# EAGLE schematic tr02 (EAGLE 6.6.0)

## Sheet 1 of 10
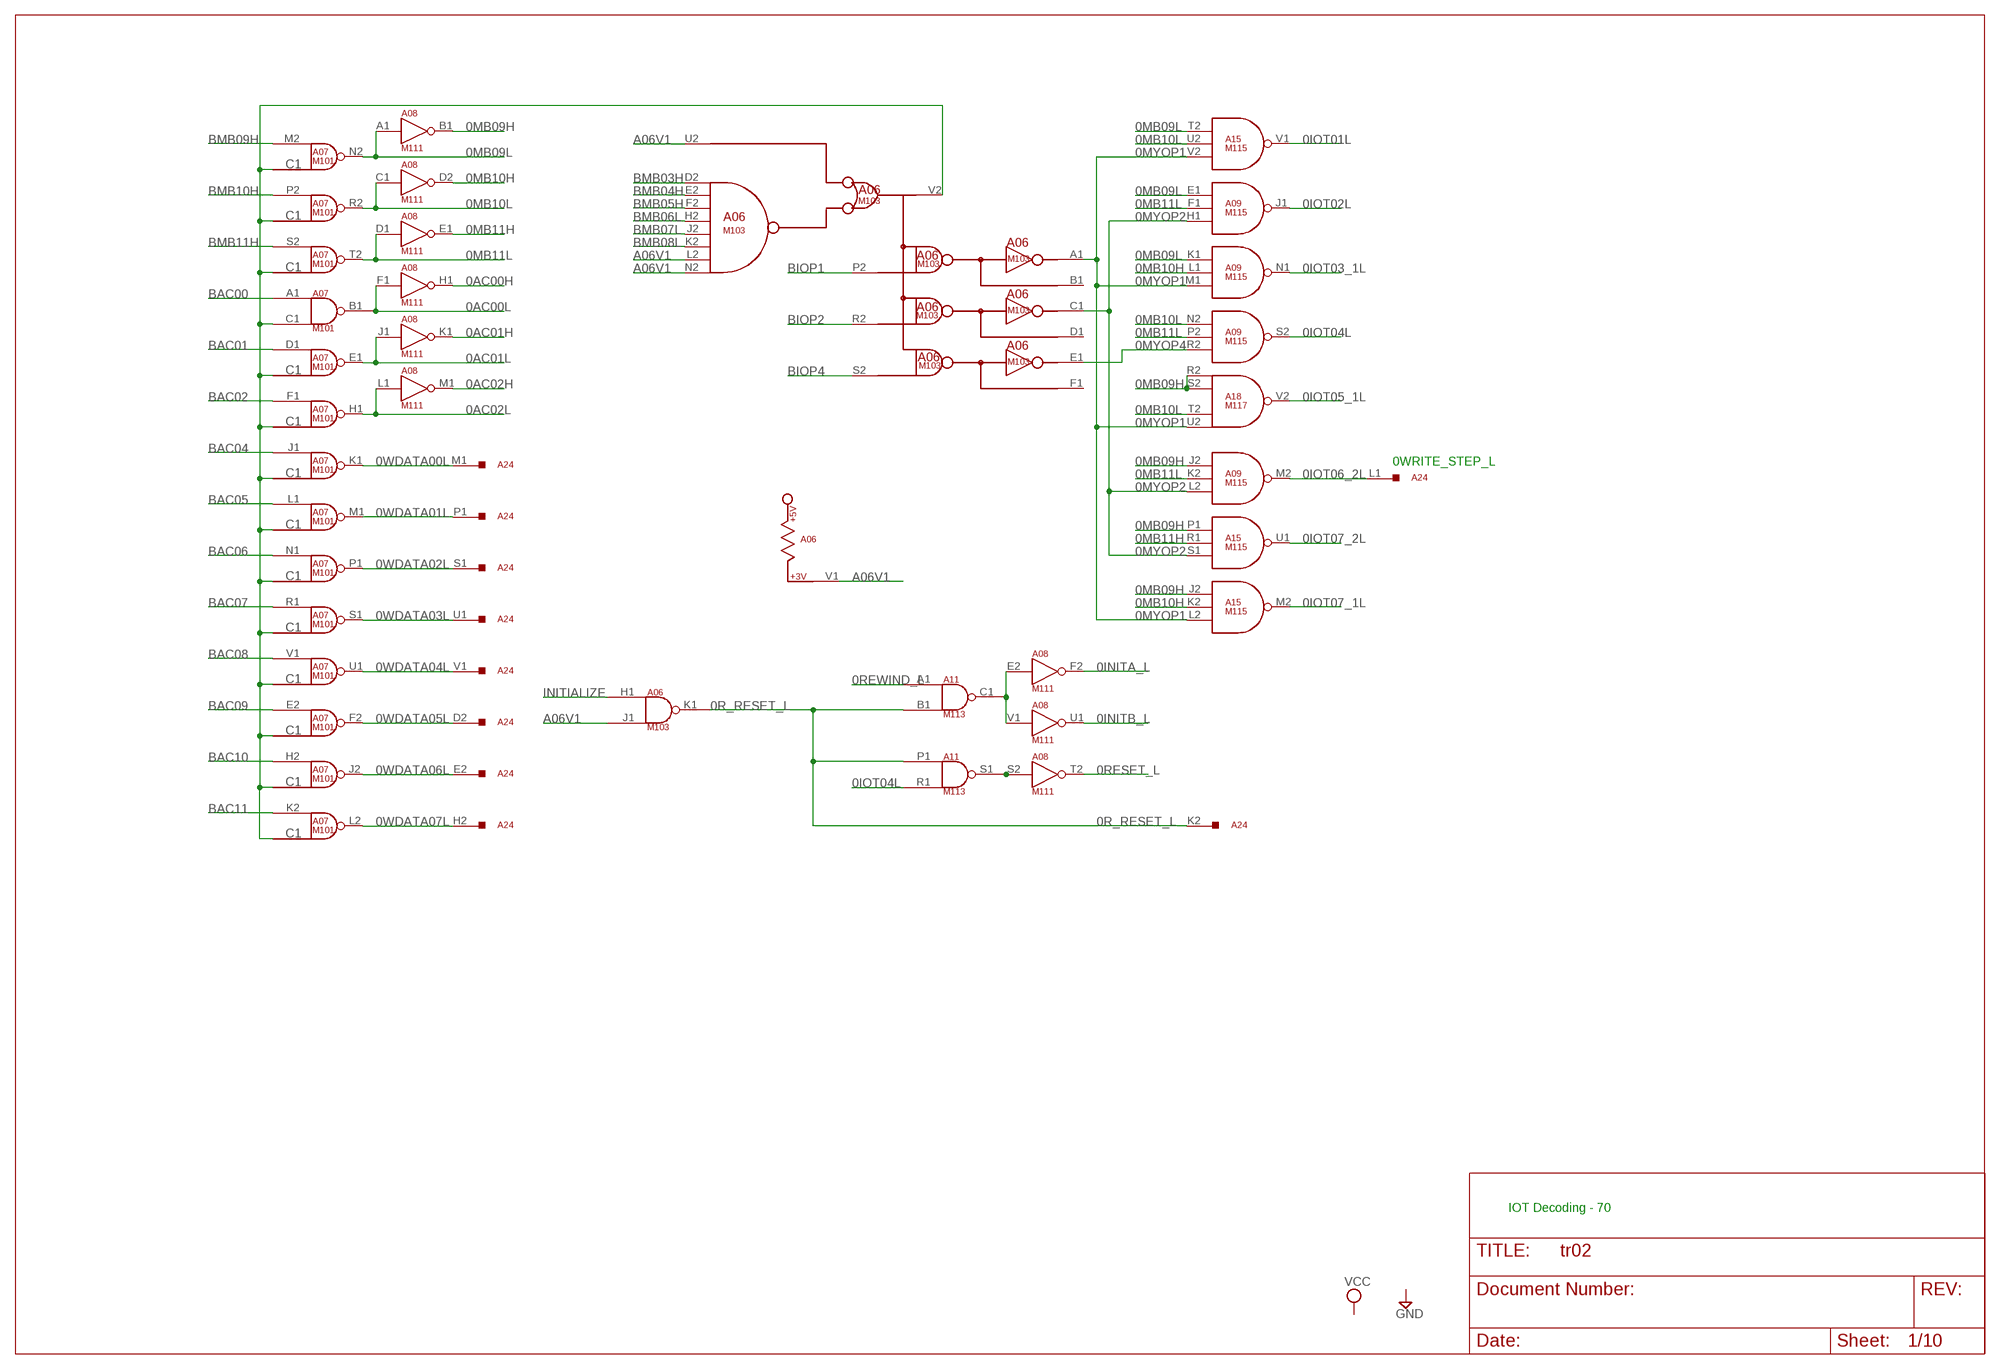
[diagram p0: schematic, sheet 1]

### Parts
A06  M103  [H807]
A07  M101  [H807]
A08  M111  [H807]
A09  M115  [H807]
A11  M113  [H807]
A15  M115  [H807]
A18  M117  [H807]
A24  G784  M916  [H807]

### Nets
0AC00H: A08.H1(H1:OUT) ; also sheet 3
0AC00L: A07.B1(B1:OUT) A08.F1(H1:IN) ; also sheet 3
0AC01H: A08.K1(K1:OUT) ; also sheet 3
0AC01L: A07.E1(E1:OUT) A08.J1(K1:IN) ; also sheet 3
0AC02H: A08.M1(M1:OUT) ; also sheet 3
0AC02L: A07.H1(H1:OUT) A08.L1(M1:IN) ; also sheet 3
0INITA_L: A08.F2(F2:OUT) ; also sheet 3
0INITB_L: A08.U1(U1:OUT) ; also sheet 3
0IOT01L: A15.V1(V1:OUT) ; also sheet 6
0IOT02L: A09.J1(J1:OUT) ; also sheet 5
0IOT03_1L: A09.N1(N1:OUT) ; also sheet 6
0IOT04L: A09.S2(S2:OUT) A11.R1(S1:IN2) ; also sheet 3
0IOT05_1L: A18.V2(V2:OUT) ; also sheet 6
0IOT06_2L: A09.M2(M2:OUT) A24.L1
0IOT07_1L: A15.M2(M2:OUT) ; also sheet 6
0IOT07_2L: A15.U1(U1:OUT) ; also sheet 5
0MB09H: A08.B1(B1:OUT) A09.J2(M2:IN1) A15.J2(M2:IN1) A15.P1(U1:IN1) A18.R2(V2:IN1) A18.S2(V2:IN2)
0MB09L: A07.N2(N2:OUT) A08.A1(B1:IN) A09.E1(J1:IN1) A09.K1(N1:IN1) A15.T2(V1:IN1)
0MB10H: A08.D2(D2:OUT) A09.L1(N1:IN2) A15.K2(M2:IN2)
0MB10L: A07.R2(R2:OUT) A08.C1(D2:IN) A09.N2(S2:IN1) A15.U2(V1:IN2) A18.T2(V2:IN3)
0MB11H: A08.E1(E1:OUT) A15.R1(U1:IN2)
0MB11L: A07.T2(T2:OUT) A08.D1(E1:IN) A09.F1(J1:IN2) A09.K2(M2:IN2) A09.P2(S2:IN2)
0MYOP1: A06.A1(V2:A1) A09.M1(N1:IN3) A15.L2(M2:IN3) A15.V2(V1:IN3) A18.U2(V2:IN4)
0MYOP2: A06.C1(V2:C1) A09.H1(J1:IN3) A09.L2(M2:IN3) A15.S1(U1:IN3)
0MYOP4: A06.E1(V2:E1) A09.R2(S2:IN3)
0R_RESET_L: A06.K1(K1:OUT) A11.B1(C1:IN2) A11.P1(S1:IN1) A24.K2
0RESET_L: A08.T2(T2:OUT) ; also sheet 5,6
0REWIND_L: A11.A1(C1:IN1) ; also sheet 3
0WDATA00L: A07.K1(K1:OUT) A24.M1
0WDATA01L: A07.M1(M1:OUT) A24.P1
0WDATA02L: A07.P1(P1:OUT) A24.S1
0WDATA03L: A07.S1(S1:OUT) A24.U1
0WDATA04L: A07.U1(U1:OUT) A24.V1
0WDATA05L: A07.F2(F2:OUT) A24.D2
0WDATA06L: A07.J2(J2:OUT) A24.E2
0WDATA07L: A07.L2(L2:OUT) A24.H2
A06V1: A06.J1(K1:IN2) A06.L2(V2:L2) A06.N2(V2:N2) A06.U2(V2:U2) A06.V1
BAC00: A07.A1(B1:IN1) ; also sheet 2,10
BAC01: A07.D1(E1:IN) ; also sheet 2,10
BAC02: A07.F1(H1:IN) ; also sheet 2,10
BAC04: A07.J1(K1:IN) ; also sheet 2,10
BAC05: A07.L1(M1:IN) ; also sheet 2,10
BAC06: A07.N1(P1:IN) ; also sheet 2,10
BAC07: A07.R1(S1:IN) ; also sheet 2,10
BAC08: A07.V1(U1:IN) ; also sheet 2,10
BAC09: A07.E2(F2:IN) ; also sheet 2,10
BAC10: A07.H2(J2:IN) ; also sheet 2,10
BAC11: A07.K2(L2:IN) ; also sheet 2,10
BIOP1: A06.P2(V2:P2) ; also sheet 2,10
BIOP2: A06.R2(V2:R2) ; also sheet 2,10
BIOP4: A06.S2(V2:S2) ; also sheet 2,10
BMB03H: A06.D2(V2:D2) ; also sheet 2,10
BMB04H: A06.E2(V2:E2) ; also sheet 2,10
BMB05H: A06.F2(V2:F2) ; also sheet 2,10
BMB06L: A06.H2(V2:H2) ; also sheet 2,10
BMB07L: A06.J2(V2:J2) ; also sheet 2,10
BMB08L: A06.K2(V2:K2) ; also sheet 10
BMB09H: A07.M2(N2:IN) ; also sheet 2,10
BMB10H: A07.P2(R2:IN) ; also sheet 2,10
BMB11H: A07.S2(T2:IN) ; also sheet 2,10
INITIALIZE: A06.H1(K1:IN1) ; also sheet 2,10
N$7: A06.V2(V2:V2) A07.C1(B1:IN2)
N$8: A08.S2(T2:IN) A11.S1(S1:OUT)
N$9: A08.E2(F2:IN) A08.V1(U1:IN) A11.C1(C1:OUT)
Unconnected: A06.B1(V2:B1) A06.D1(V2:D1) A06.F1(V2:F1) A06.L1(N1:IN1) A06.M1(N1:IN2) A06.N1(N1:OUT) A07.U2(V2:IN) A07.V2(V2:OUT) A11.V1 A18.U1 A18.V1 A24.A2 A24.B2 A24.M2 A24.V2

### Notes on the sheet
- 0WRITE_STEP_L
- IOT Decoding - 70

## Sheet 2 of 10
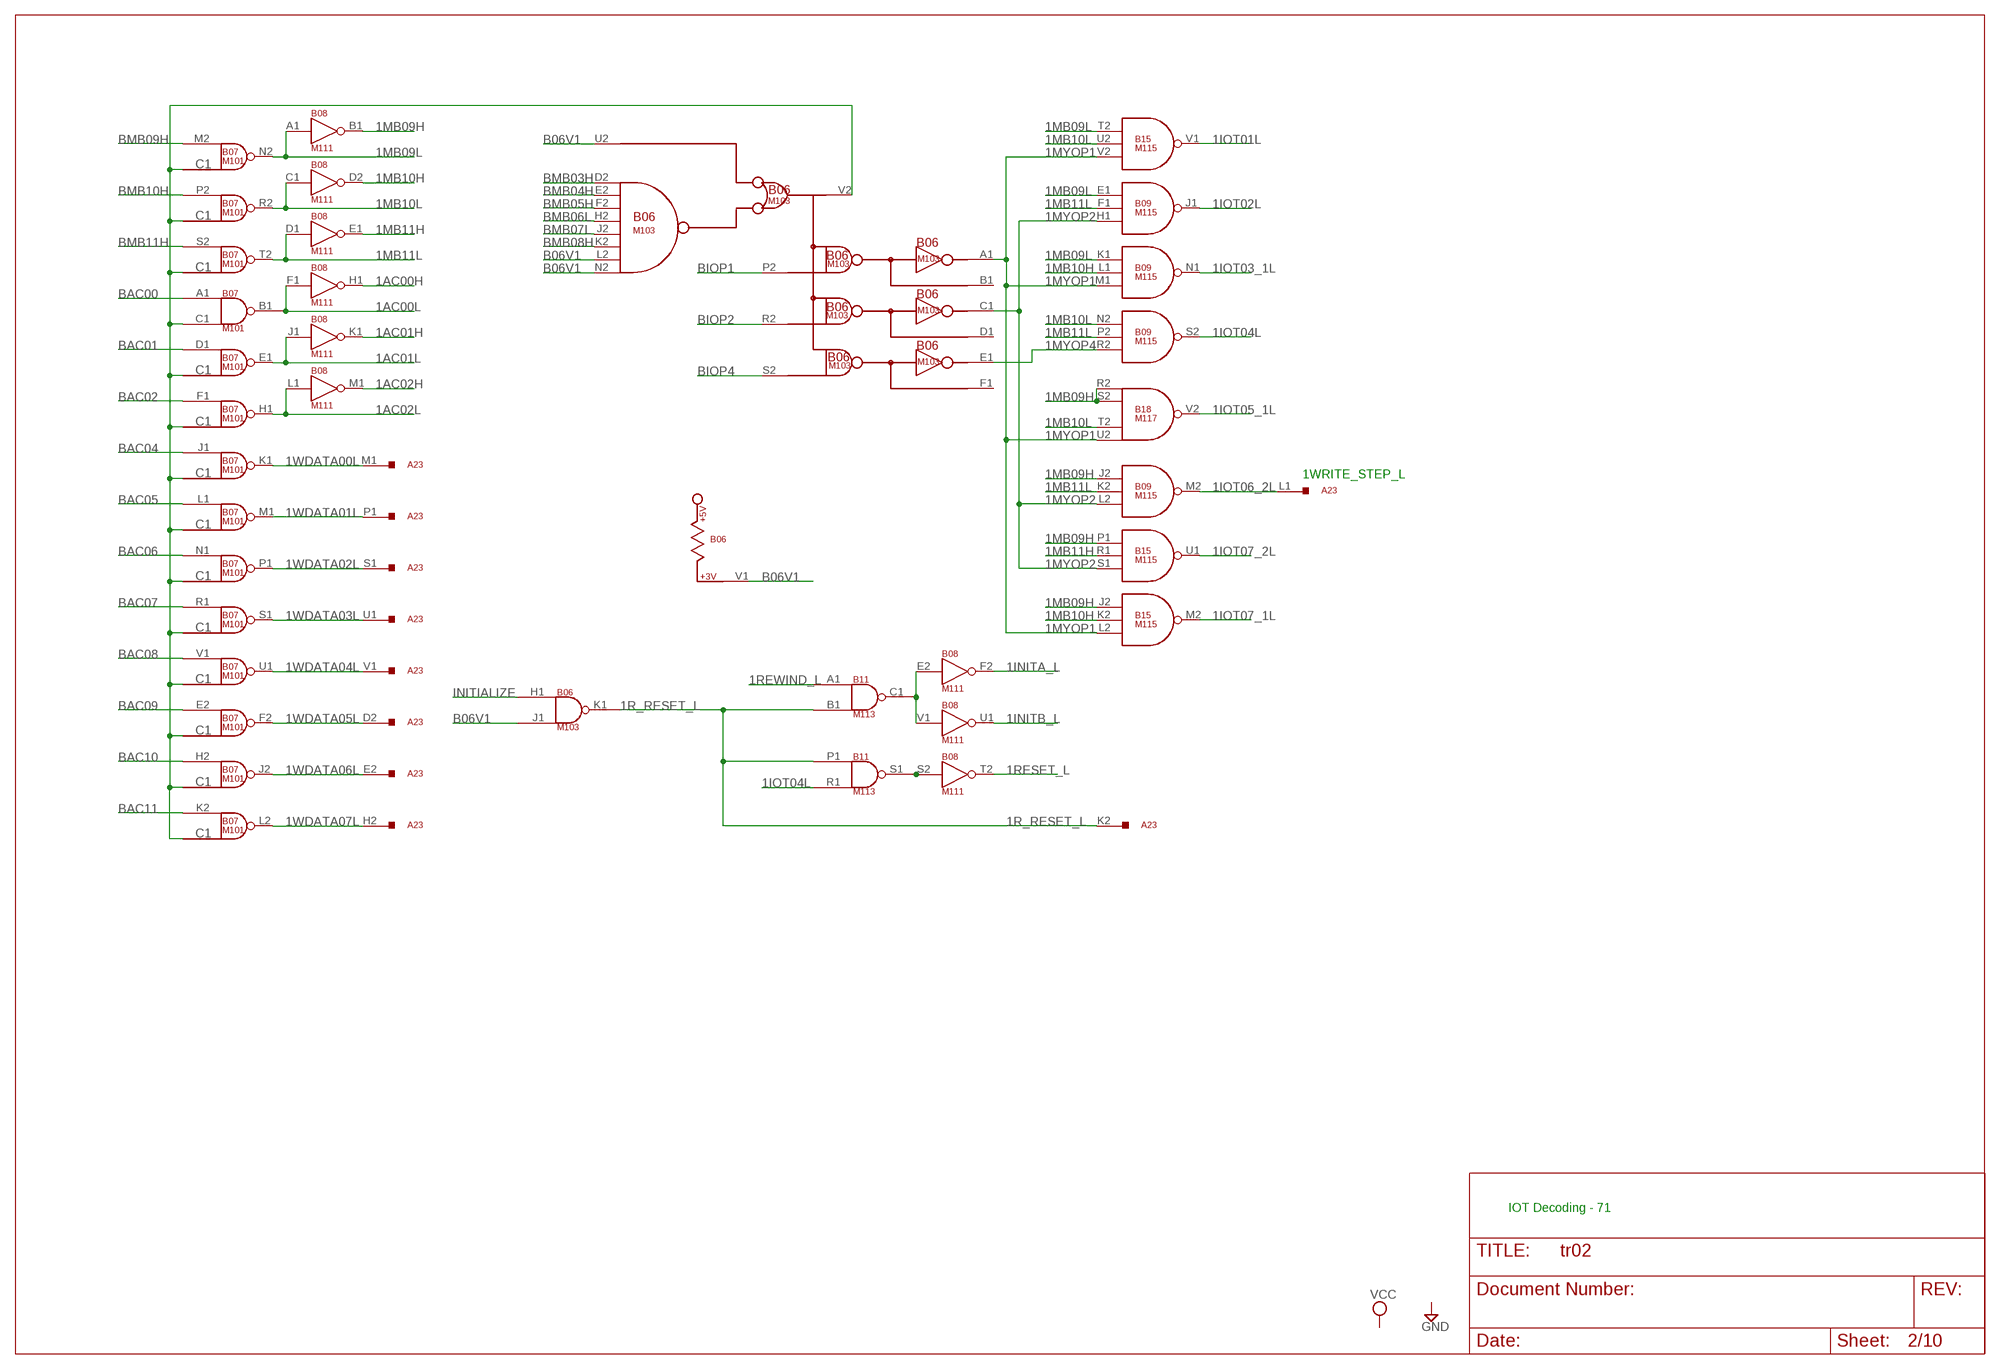
[diagram p1: schematic, sheet 2]

### Parts
A23  G784  M916  [H807]
B06  M103  [H807]
B07  M101  [H807]
B08  M111  [H807]
B09  M115  [H807]
B11  M113  [H807]
B15  M115  [H807]
B18  M117  [H807]

### Nets
1AC00H: B08.H1(H1:OUT)
1AC00L: B07.B1(B1:OUT) B08.F1(H1:IN)
1AC01H: B08.K1(K1:OUT)
1AC01L: B07.E1(E1:OUT) B08.J1(K1:IN)
1AC02H: B08.M1(M1:OUT)
1AC02L: B07.H1(H1:OUT) B08.L1(M1:IN)
1INITA_L: B08.F2(F2:OUT)
1INITB_L: B08.U1(U1:OUT)
1IOT01L: B15.V1(V1:OUT)
1IOT02L: B09.J1(J1:OUT)
1IOT03_1L: B09.N1(N1:OUT)
1IOT04L: B09.S2(S2:OUT) B11.R1(S1:IN2)
1IOT05_1L: B18.V2(V2:OUT)
1IOT06_2L: A23.L1 B09.M2(M2:OUT)
1IOT07_1L: B15.M2(M2:OUT)
1IOT07_2L: B15.U1(U1:OUT)
1MB09H: B08.B1(B1:OUT) B09.J2(M2:IN1) B15.J2(M2:IN1) B15.P1(U1:IN1) B18.R2(V2:IN1) B18.S2(V2:IN2)
1MB09L: B07.N2(N2:OUT) B08.A1(B1:IN) B09.E1(J1:IN1) B09.K1(N1:IN1) B15.T2(V1:IN1)
1MB10H: B08.D2(D2:OUT) B09.L1(N1:IN2) B15.K2(M2:IN2)
1MB10L: B07.R2(R2:OUT) B08.C1(D2:IN) B09.N2(S2:IN1) B15.U2(V1:IN2) B18.T2(V2:IN3)
1MB11H: B08.E1(E1:OUT) B15.R1(U1:IN2)
1MB11L: B07.T2(T2:OUT) B08.D1(E1:IN) B09.F1(J1:IN2) B09.K2(M2:IN2) B09.P2(S2:IN2)
1MYOP1: B06.A1(V2:A1) B09.M1(N1:IN3) B15.L2(M2:IN3) B15.V2(V1:IN3) B18.U2(V2:IN4)
1MYOP2: B06.C1(V2:C1) B09.H1(J1:IN3) B09.L2(M2:IN3) B15.S1(U1:IN3)
1MYOP4: B06.E1(V2:E1) B09.R2(S2:IN3)
1R_RESET_L: A23.K2 B06.K1(K1:OUT) B11.B1(C1:IN2) B11.P1(S1:IN1)
1RESET_L: B08.T2(T2:OUT)
1REWIND_L: B11.A1(C1:IN1)
1WDATA00L: A23.M1 B07.K1(K1:OUT)
1WDATA01L: A23.P1 B07.M1(M1:OUT)
1WDATA02L: A23.S1 B07.P1(P1:OUT)
1WDATA03L: A23.U1 B07.S1(S1:OUT)
1WDATA04L: A23.V1 B07.U1(U1:OUT)
1WDATA05L: A23.D2 B07.F2(F2:OUT)
1WDATA06L: A23.E2 B07.J2(J2:OUT)
1WDATA07L: A23.H2 B07.L2(L2:OUT)
B06V1: B06.J1(K1:IN2) B06.L2(V2:L2) B06.N2(V2:N2) B06.U2(V2:U2) B06.V1
BAC00: B07.A1(B1:IN1) ; also sheet 1,10
BAC01: B07.D1(E1:IN) ; also sheet 1,10
BAC02: B07.F1(H1:IN) ; also sheet 1,10
BAC04: B07.J1(K1:IN) ; also sheet 1,10
BAC05: B07.L1(M1:IN) ; also sheet 1,10
BAC06: B07.N1(P1:IN) ; also sheet 1,10
BAC07: B07.R1(S1:IN) ; also sheet 1,10
BAC08: B07.V1(U1:IN) ; also sheet 1,10
BAC09: B07.E2(F2:IN) ; also sheet 1,10
BAC10: B07.H2(J2:IN) ; also sheet 1,10
BAC11: B07.K2(L2:IN) ; also sheet 1,10
BIOP1: B06.P2(V2:P2) ; also sheet 1,10
BIOP2: B06.R2(V2:R2) ; also sheet 1,10
BIOP4: B06.S2(V2:S2) ; also sheet 1,10
BMB03H: B06.D2(V2:D2) ; also sheet 1,10
BMB04H: B06.E2(V2:E2) ; also sheet 1,10
BMB05H: B06.F2(V2:F2) ; also sheet 1,10
BMB06L: B06.H2(V2:H2) ; also sheet 1,10
BMB07L: B06.J2(V2:J2) ; also sheet 1,10
BMB08H: B06.K2(V2:K2) ; also sheet 10
BMB09H: B07.M2(N2:IN) ; also sheet 1,10
BMB10H: B07.P2(R2:IN) ; also sheet 1,10
BMB11H: B07.S2(T2:IN) ; also sheet 1,10
INITIALIZE: B06.H1(K1:IN1) ; also sheet 1,10
N$1: B06.V2(V2:V2) B07.C1(B1:IN2)
N$2: B08.S2(T2:IN) B11.S1(S1:OUT)
N$3: B08.E2(F2:IN) B08.V1(U1:IN) B11.C1(C1:OUT)
Unconnected: A23.A2 A23.B1 A23.B2 A23.D1 A23.E1 A23.H1 A23.J1 A23.M2 A23.P2 A23.S2 A23.T2 A23.V2 B06.B1(V2:B1) B06.D1(V2:D1) B06.F1(V2:F1) B06.L1(N1:IN1) B06.M1(N1:IN2) B06.N1(N1:OUT) B07.U2(V2:IN) B07.V2(V2:OUT) B08.H2(J2:IN) B08.J2(J2:OUT) B08.K2(L2:IN) B08.L2(L2:OUT) B08.M2(N2:IN) B08.N1(P1:IN) B08.N2(N2:OUT) B08.P1(P1:OUT) B08.P2(R2:IN) B08.R1(S1:IN) B08.R2(R2:OUT) B08.S1(S1:OUT) B08.U2(V2:IN) B08.V2(V2:OUT) B09.A1(D1:IN1) B09.B1(D1:IN2) B09.C1(D1:IN3) B09.D1(D1:OUT) B09.D2(H2:IN1) B09.E2(H2:IN2) B09.F2(H2:IN3) B09.H2(H2:OUT) B09.P1(U1:IN1) B09.R1(U1:IN2) B09.S1(U1:IN3) B09.T2(V1:IN1) B09.U1(U1:OUT) B09.U2(V1:IN2) B09.V1(V1:OUT) B09.V2(V1:IN3) B11.D1(F1:IN1) B11.D2(F2:IN1) B11.E1(F1:IN2) B11.E2(F2:IN2) B11.F1(F1:OUT) B11.F2(F2:OUT) B11.H1(K1:IN1) B11.H2(K2:IN1) B11.J1(K1:IN2) B11.J2(K2:IN2) B11.K1(K1:OUT) B11.K2(K2:OUT) B11.L1(N1:IN1) B11.L2(N2:IN1) B11.M1(N1:IN2) B11.M2(N2:IN2) B11.N1(N1:OUT) B11.N2(N2:OUT) B11.P2(S2:IN1) B11.R2(S2:IN2) B11.S2(S2:OUT) B11.T2(V2:IN1) B11.U1 B11.U2(V2:IN2) B11.V1 B11.V2(V2:OUT) B15.A1(D1:IN1) B15.B1(D1:IN2) B15.C1(D1:IN3) B15.D1(D1:OUT) B15.D2(H2:IN1) B15.E1(J1:IN1) B15.E2(H2:IN2) B15.F1(J1:IN2) B15.F2(H2:IN3) B15.H1(J1:IN3) B15.H2(H2:OUT) B15.J1(J1:OUT) B15.K1(N1:IN1) B15.L1(N1:IN2) B15.M1(N1:IN3) B15.N1(N1:OUT) B15.N2(S2:IN1) B15.P2(S2:IN2) B15.R2(S2:IN3) B15.S2(S2:OUT) B18.A1(E1:IN1) B18.B1(E1:IN2) B18.C1(E1:IN3) B18.D1(E1:IN4) B18.D2(J2:IN1) B18.E1(E1:OUT) B18.E2(J2:IN2) B18.F1(L1:IN1) B18.F2(J2:IN3) B18.H1(L1:IN2) B18.H2(J2:IN4) B18.J1(L1:IN3) B18.J2(J2:OUT) B18.K1(L1:IN4) B18.K2(P2:IN1) B18.L1(L1:OUT) B18.L2(P2:IN2) B18.M1(S1:IN1) B18.M2(P2:IN3) B18.N1(S1:IN2) B18.N2(P2:IN4) B18.P1(S1:IN3) B18.P2(P2:OUT) B18.R1(S1:IN4) B18.S1(S1:OUT) B18.U1 B18.V1

### Notes on the sheet
- 1WRITE_STEP_L
- IOT Decoding - 71

## Sheet 3 of 10
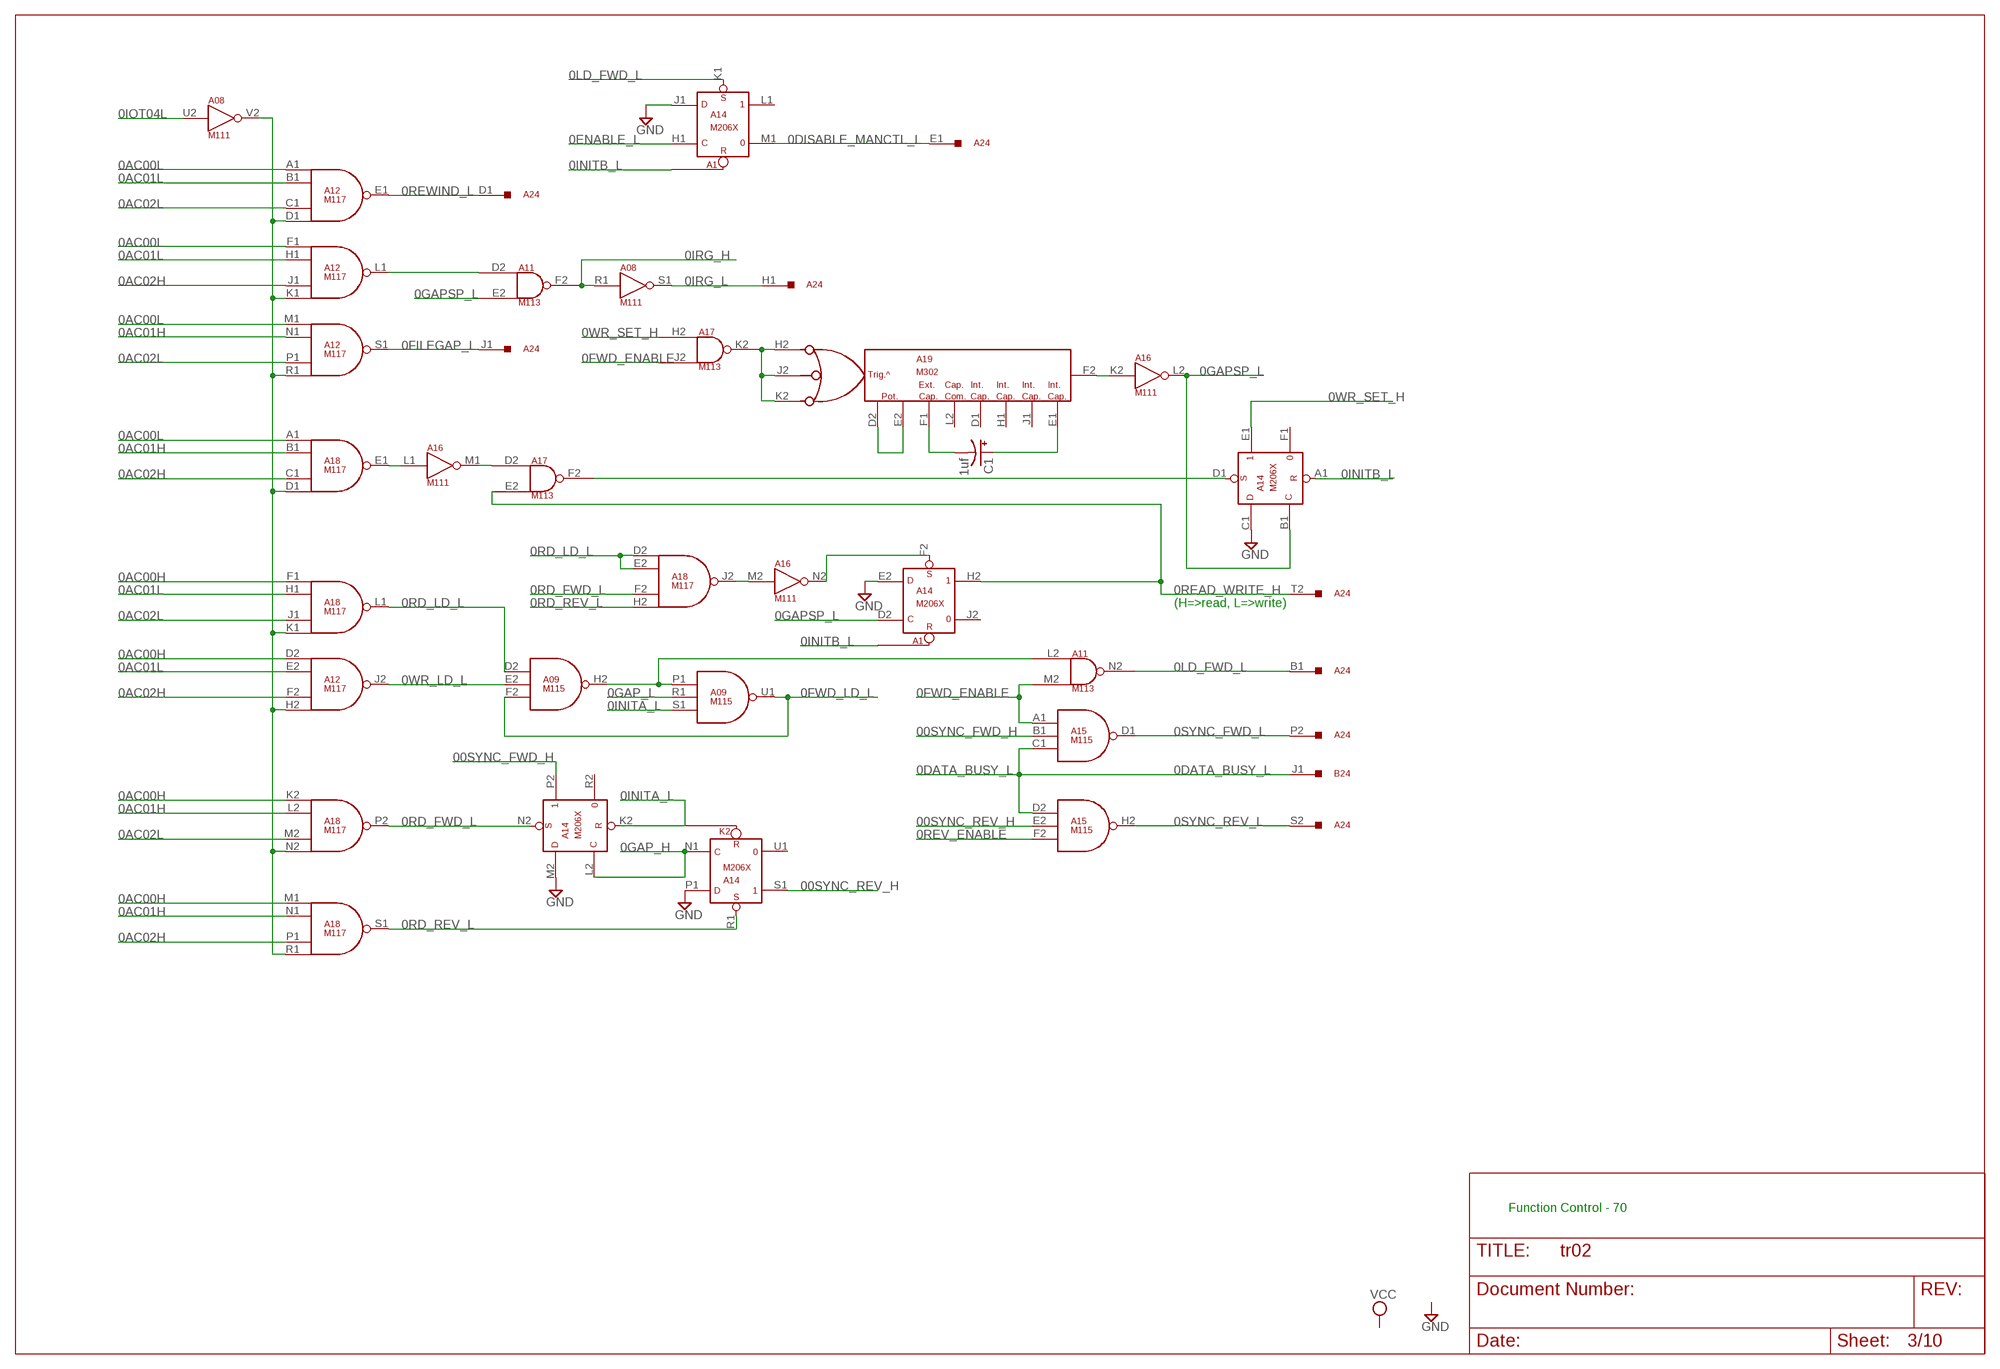
[diagram p2: schematic, sheet 3]

### Parts
A12  M117  [H807]
A14  M206X  [H807]
A16  M111  [H807]
A17  M113  [H807]
A19  M302  [H807]
B24  G784  M916  [H807]
C1  1uf  CPOL-USE22-6AXIAL  [E22-6]

### Nets
0AC00H: A12.D2(J2:IN1) A18.F1(L1:IN1) A18.K2(P2:IN1) A18.M1(S1:IN1) ; also sheet 1
0AC00L: A12.A1(E1:IN1) A12.F1(L1:IN1) A12.M1(S1:IN1) A18.A1(E1:IN1) ; also sheet 1
0AC01H: A12.N1(S1:IN2) A18.B1(E1:IN2) A18.L2(P2:IN2) A18.N1(S1:IN2) ; also sheet 1
0AC01L: A12.B1(E1:IN2) A12.E2(J2:IN2) A12.H1(L1:IN2) A18.H1(L1:IN2) ; also sheet 1
0AC02H: A12.F2(J2:IN3) A12.J1(L1:IN3) A18.C1(E1:IN3) A18.P1(S1:IN3) ; also sheet 1
0AC02L: A12.C1(E1:IN3) A12.P1(S1:IN3) A18.J1(L1:IN3) A18.M2(P2:IN3) ; also sheet 1
0DATA_BUSY_L: A15.C1(D1:IN3) A15.D2(H2:IN1) B24.J1
0DISABLE_MANCTL_L: A14.M1 A24.E1 ; also sheet 4
0ENABLE_L: A14.H1(L1:C) ; also sheet 7
0FILEGAP_L: A12.S1(S1:OUT) A24.J1
0FWD_ENABLE: A11.M2(N2:IN2) A15.A1(D1:IN1) A17.J2(K2:IN2) ; also sheet 4
0FWD_LD_L: A09.F2(H2:IN3) A09.U1(U1:OUT) ; also sheet 4
0GAP_H: A14.L2(P2:C) A14.N1(S1:C) ; also sheet 4,6
0GAP_L: A09.R1(U1:IN2) ; also sheet 4
0GAPSP_L: A11.E2(F2:IN2) A14.B1(E1:C) A14.D2(H2:C) A16.L2(L2:OUT)
0INITA_L: A09.S1(U1:IN3) A14.K2(P2:R) ; also sheet 1
0INITB_L: A14.A1(E1:R) ; also sheet 1
0IOT04L: A08.U2(V2:IN) ; also sheet 1
0IRG_H: A08.R1(S1:IN) A11.F2(F2:OUT)
0IRG_L: A08.S1(S1:OUT) A24.H1 ; also sheet 4
0LD_FWD_L: A11.N2(N2:OUT) A14.K1(L1:S) A24.B1
0RD_FWD_L: A14.N2(P2:S) A18.F2(J2:IN3) A18.P2(P2:OUT)
0RD_LD_L: A09.D2(H2:IN1) A18.D2(J2:IN1) A18.E2(J2:IN2) A18.L1(L1:OUT)
0RD_REV_L: A14.R1(S1:S) A18.H2(J2:IN4) A18.S1(S1:OUT)
0READ_WRITE_H: A14.H2 A17.E2(F2:IN2) A24.T2 ; also sheet 5,6
0REV_ENABLE: A15.F2(H2:IN3) ; also sheet 4
0REWIND_L: A12.E1(E1:OUT) A24.D1 ; also sheet 1
00SYNC_FWD_H: A14.P2 A15.B1(D1:IN2)
0SYNC_FWD_L: A15.D1(D1:OUT) A24.P2 ; also sheet 4
00SYNC_REV_H: A14.S1 A15.E2(H2:IN2)
0SYNC_REV_L: A15.H2(H2:OUT) A24.S2 ; also sheet 4
0WR_LD_L: A09.E2(H2:IN2) A12.J2(J2:OUT)
0WR_SET_H: A14.E1 A17.H2(K2:IN1)
GND [supply]: A14.C1(E1:D) A14.E2(H2:D) A14.J1(L1:D) A14.M2(P2:D) A14.P1(S1:D) ; also sheet 5,6,7,10
N$4: A16.M1(M1:OUT) A17.D2(F2:IN1)
N$5: A16.L1(M1:IN) A18.E1(E1:OUT)
N$6: A17.K2(K2:OUT) A19.H2(F2:H2) A19.J2(F2:J2) A19.K2(F2:K2)
N$10: A19.F1(F2:F1) C1.-
N$11: A11.D2(F2:IN1) A12.L1(L1:OUT)
N$12: A08.V2(V2:OUT) A12.D1(E1:IN4) A12.H2(J2:IN4) A12.K1(L1:IN4) A12.R1(S1:IN4) A18.D1(E1:IN4) A18.K1(L1:IN4) A18.N2(P2:IN4) A18.R1(S1:IN4)
N$13: A19.E1(F2:E1) C1.+
N$14: A19.D2(F2:D2) A19.E2(F2:E2)
N$15: A16.K2(L2:IN) A19.F2(F2:F2)
N$16: A14.D1(E1:S) A17.F2(F2:OUT)
N$17: A14.F2(H2:S) A16.N2(N2:OUT)
N$18: A09.H2(H2:OUT) A09.P1(U1:IN1) A11.L2(N2:IN1)
N$19: A16.M2(N2:IN) A18.J2(J2:OUT)
Unconnected: A12.U1 A12.V1 A14.F1 A14.J2 A14.L1 A14.R2 A14.U1 A16.P2(R2:IN) A16.R2(R2:OUT) A16.S2(T2:IN) A16.T2(T2:OUT) A16.U1(U1:OUT) A16.U2(V2:IN) A16.V1(U1:IN) A16.V2(V2:OUT) A17.U1 A17.V1 A19.D1(F2:D1) A19.H1(F2:H1) A19.J1(F2:J1) A19.L2(F2:L2) B24.A2 B24.B2 B24.S2

### Notes on the sheet
- (H=>read, L=>write)
- Function Control - 70

## Sheet 4 of 10
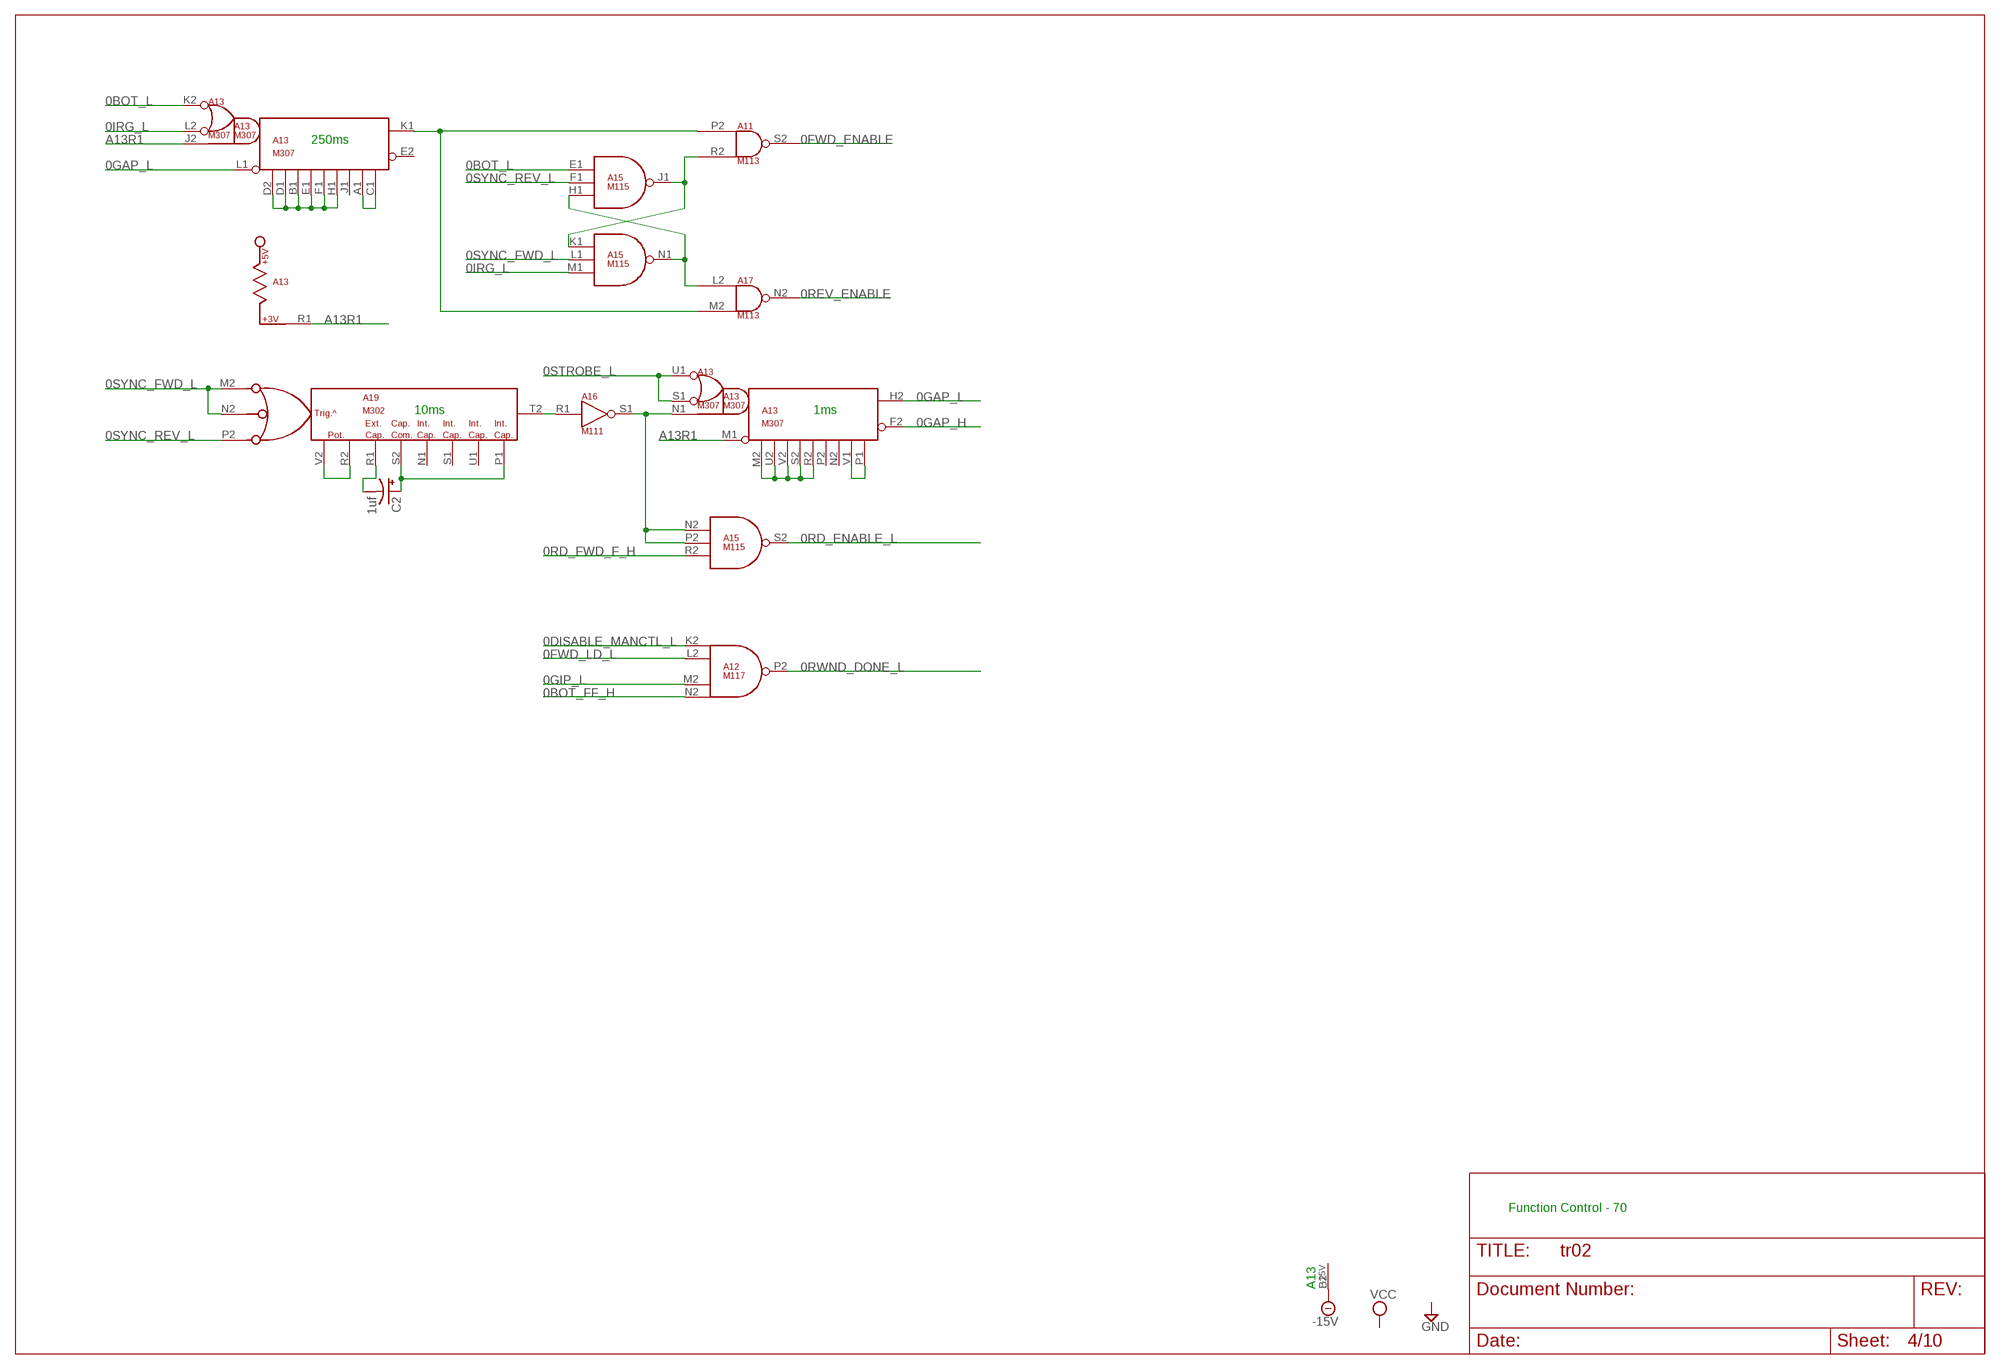
[diagram p3: schematic, sheet 4]

### Parts
A13  M307  [H807]
C2  1uf  CPOL-USE22-6AXIAL  [E22-6]

### Nets
0BOT_FF_H: A12.N2(P2:IN4) ; also sheet 5
0BOT_L: A13.K2(K1:U1) A15.E1(J1:IN1) ; also sheet 5
0DISABLE_MANCTL_L: A12.K2(P2:IN1) ; also sheet 3
0FWD_ENABLE: A11.S2(S2:OUT) ; also sheet 3
0FWD_LD_L: A12.L2(P2:IN2) ; also sheet 3
0GAP_H: A13.F2(H2:F2) ; also sheet 3,6
0GAP_L: A13.H2(H2:H2) A13.L1(K1:M1) ; also sheet 3
0GIP_L: A12.M2(P2:IN3) ; also sheet 5
0IRG_L: A13.L2(K1:S1) A15.M1(N1:IN3) ; also sheet 3
0RD_ENABLE_L: A15.S2(S2:OUT) ; also sheet 6
0RD_FWD_F_H: A15.R2(S2:IN3)
0REV_ENABLE: A17.N2(N2:OUT) ; also sheet 3
0RWND_DONE_L: A12.P2(P2:OUT) ; also sheet 6
0STROBE_L: A13.S1(H2:S1) A13.U1(H2:U1) ; also sheet 6
0SYNC_FWD_L: A15.L1(N1:IN2) A19.M2(T2:H2) A19.N2(T2:J2) ; also sheet 3
0SYNC_REV_L: A15.F1(J1:IN2) A19.P2(T2:K2) ; also sheet 3
-15V: A13.B2(-15V)
A13R1: A13.J2(K1:N1) A13.M1(H2:M1) A13.R1
N$20: A13.B1(K1:V2) A13.D1(K1:U2) A13.D2(K1:M2) A13.E1(K1:S2) A13.F1(K1:R2) A13.H1(K1:P2)
N$21: A15.H1(J1:IN3) A15.N1(N1:OUT) A17.L2(N2:IN1)
N$22: A13.A1(K1:V1) A13.C1(K1:P1)
N$23: A11.P2(S2:IN1) A13.K1(K1:H2) A17.M2(N2:IN2)
N$24: A11.R2(S2:IN2) A15.J1(J1:OUT) A15.K1(N1:IN1)
N$25: A19.R2(T2:E2) A19.V2(T2:D2)
N$26: A19.R1(T2:F1) C2.-
N$27: A19.P1(T2:E1) A19.S2(T2:L2) C2.+
N$28: A16.R1(S1:IN) A19.T2(T2:F2)
N$29: A13.N1(H2:N1) A15.N2(S2:IN1) A15.P2(S2:IN2) A16.S1(S1:OUT)
N$30: A13.M2(H2:M2) A13.R2(H2:R2) A13.S2(H2:S2) A13.U2(H2:U2) A13.V2(H2:V2)
N$31: A13.P1(H2:P1) A13.V1(H2:V1)
Unconnected: A13.E2(K1:F2) A13.J1(K1:N2) A13.N2(H2:N2) A13.P2(H2:P2) A19.N1(T2:D1) A19.S1(T2:H1) A19.U1(T2:J1)

### Notes on the sheet
- 250ms
- 10ms | 1ms
- Function Control - 70
- A13

## Sheet 5 of 10
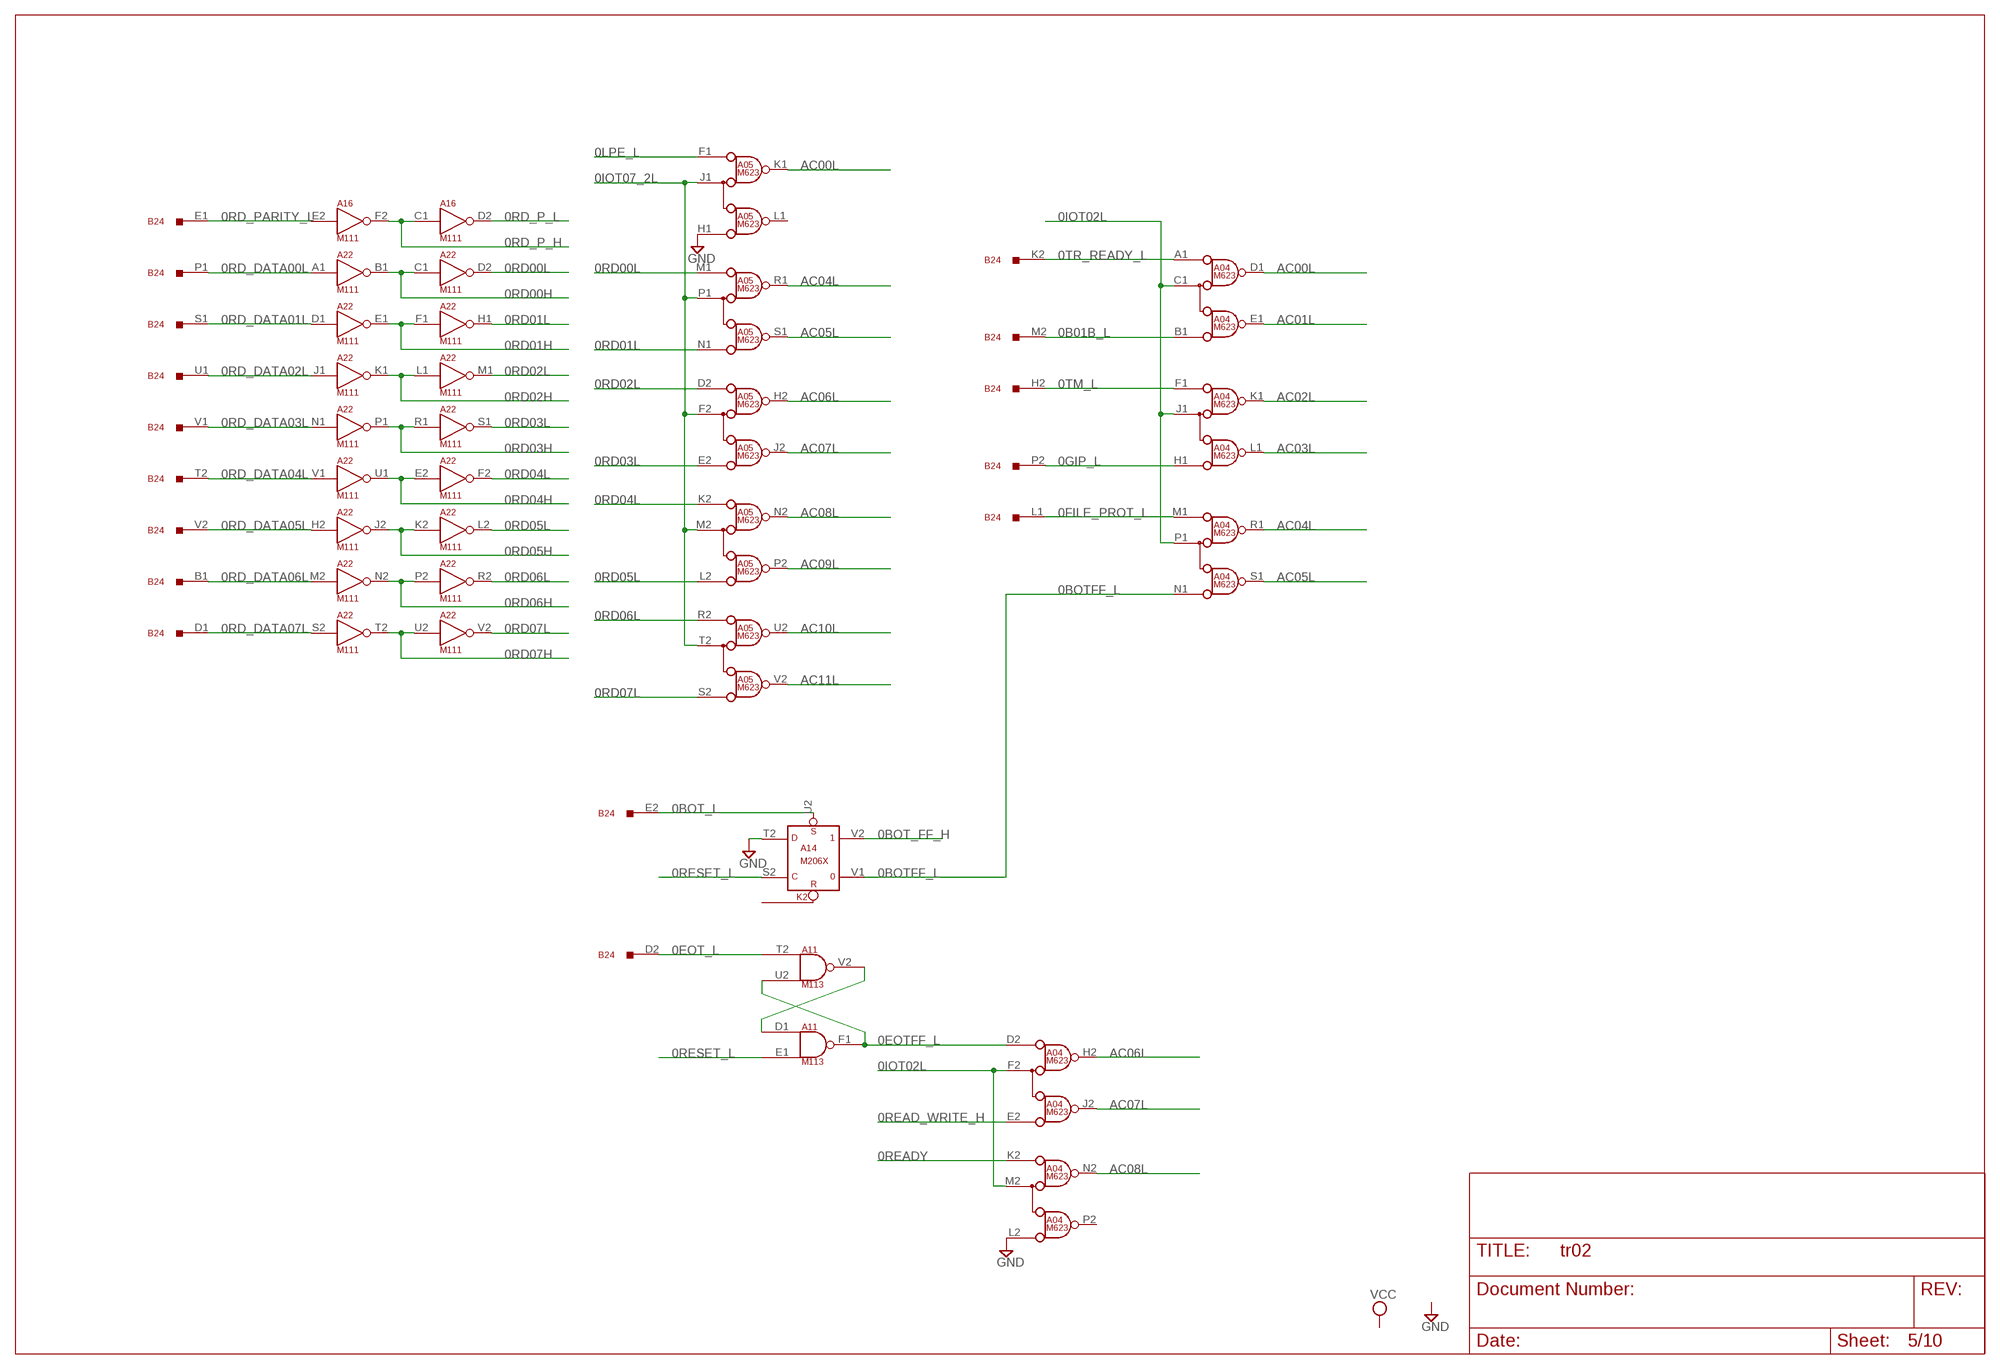
[diagram p4: schematic, sheet 5]

### Parts
A04  M623  [H807]
A05  M623  [H807]
A22  M111  [H807]

### Nets
0B01B_L: A04.B1(D1:B) B24.M2
0BOT_FF_H: A14.V2 ; also sheet 4
0BOT_L: A14.U2(V2:S) B24.E2 ; also sheet 4
0BOTFF_L: A04.N1(R1:B) A14.V1
0EOT_L: A11.T2(V2:IN1) B24.D2
0EOTFF_L: A04.D2(H2:A) A11.F1(F1:OUT) A11.U2(V2:IN2)
0FILE_PROT_L: A04.M1(R1:A) B24.L1
0GIP_L: A04.H1(K1:B) B24.P2 ; also sheet 4
0IOT02L: A04.C1(D1:C) A04.F2(H2:C) A04.J1(K1:C) A04.M2(N2:C) A04.P1(R1:C) ; also sheet 1
0IOT07_2L: A05.F2(H2:C) A05.J1(K1:C) A05.M2(N2:C) A05.P1(R1:C) A05.T2(U2:C) ; also sheet 1
0LPE_L: A05.F1(K1:A) ; also sheet 7
0RD00H: A22.B1(B1:OUT) A22.C1(D2:IN) ; also sheet 7
0RD00L: A05.M1(R1:A) A22.D2(D2:OUT) ; also sheet 7
0RD01H: A22.E1(E1:OUT) A22.F1(H1:IN) ; also sheet 7
0RD01L: A05.N1(R1:B) A22.H1(H1:OUT) ; also sheet 7
0RD02H: A22.K1(K1:OUT) A22.L1(M1:IN) ; also sheet 7
0RD02L: A05.D2(H2:A) A22.M1(M1:OUT) ; also sheet 7
0RD03H: A22.P1(P1:OUT) A22.R1(S1:IN) ; also sheet 7
0RD03L: A05.E2(H2:B) A22.S1(S1:OUT) ; also sheet 7
0RD04H: A22.E2(F2:IN) A22.U1(U1:OUT) ; also sheet 7
0RD04L: A05.K2(N2:A) A22.F2(F2:OUT) ; also sheet 7
0RD05H: A22.J2(J2:OUT) A22.K2(L2:IN) ; also sheet 7
0RD05L: A05.L2(N2:B) A22.L2(L2:OUT) ; also sheet 7
0RD06H: A22.N2(N2:OUT) A22.P2(R2:IN) ; also sheet 7
0RD06L: A05.R2(U2:A) A22.R2(R2:OUT) ; also sheet 7
0RD07H: A22.T2(T2:OUT) A22.U2(V2:IN) ; also sheet 7
0RD07L: A05.S2(U2:B) A22.V2(V2:OUT) ; also sheet 7
0RD_DATA00L: A22.A1(B1:IN) B24.P1
0RD_DATA01L: A22.D1(E1:IN) B24.S1
0RD_DATA02L: A22.J1(K1:IN) B24.U1
0RD_DATA03L: A22.N1(P1:IN) B24.V1
0RD_DATA04L: A22.V1(U1:IN) B24.T2
0RD_DATA05L: A22.H2(J2:IN) B24.V2
0RD_DATA06L: A22.M2(N2:IN) B24.B1
0RD_DATA07L: A22.S2(T2:IN) B24.D1
0RD_P_H: A16.C1(D2:IN) A16.F2(F2:OUT) ; also sheet 7
0RD_P_L: A16.D2(D2:OUT)
0RD_PARITY_L: A16.E2(F2:IN) B24.E1
0READ_WRITE_H: A04.E2(H2:B) ; also sheet 3,6
0READY: A04.K2(N2:A)
0RESET_L: A11.E1(F1:IN2) A14.S2(V2:C) ; also sheet 1,6
0TM_L: A04.F1(K1:A) B24.H2
0TR_READY_L: A04.A1(D1:A) B24.K2 ; also sheet 6
AC00L: A04.D1(D1:D) A05.K1(K1:D) ; also sheet 10
AC01L: A04.E1(D1:E) ; also sheet 10
AC02L: A04.K1(K1:D) ; also sheet 10
AC03L: A04.L1(K1:E) ; also sheet 10
AC04L: A04.R1(R1:D) A05.R1(R1:D) ; also sheet 10
AC05L: A04.S1(R1:E) A05.S1(R1:E) ; also sheet 10
AC06L: A04.H2(H2:D) A05.H2(H2:D) ; also sheet 10
AC07L: A04.J2(H2:E) A05.J2(H2:E) ; also sheet 10
AC08L: A04.N2(N2:D) A05.N2(N2:D) ; also sheet 10
AC09L: A05.P2(N2:E) ; also sheet 10
AC10L: A05.U2(U2:D) ; also sheet 10
AC11L: A05.V2(U2:E) ; also sheet 10
GND [supply]: A04.L2(N2:B) A05.H1(K1:B) A14.T2(V2:D) ; also sheet 3,6,7,10
N$33: A11.D1(F1:IN1) A11.V2(V2:OUT)
Unconnected: A04.P2(N2:E) A05.L1(K1:E)

## Sheet 6 of 10
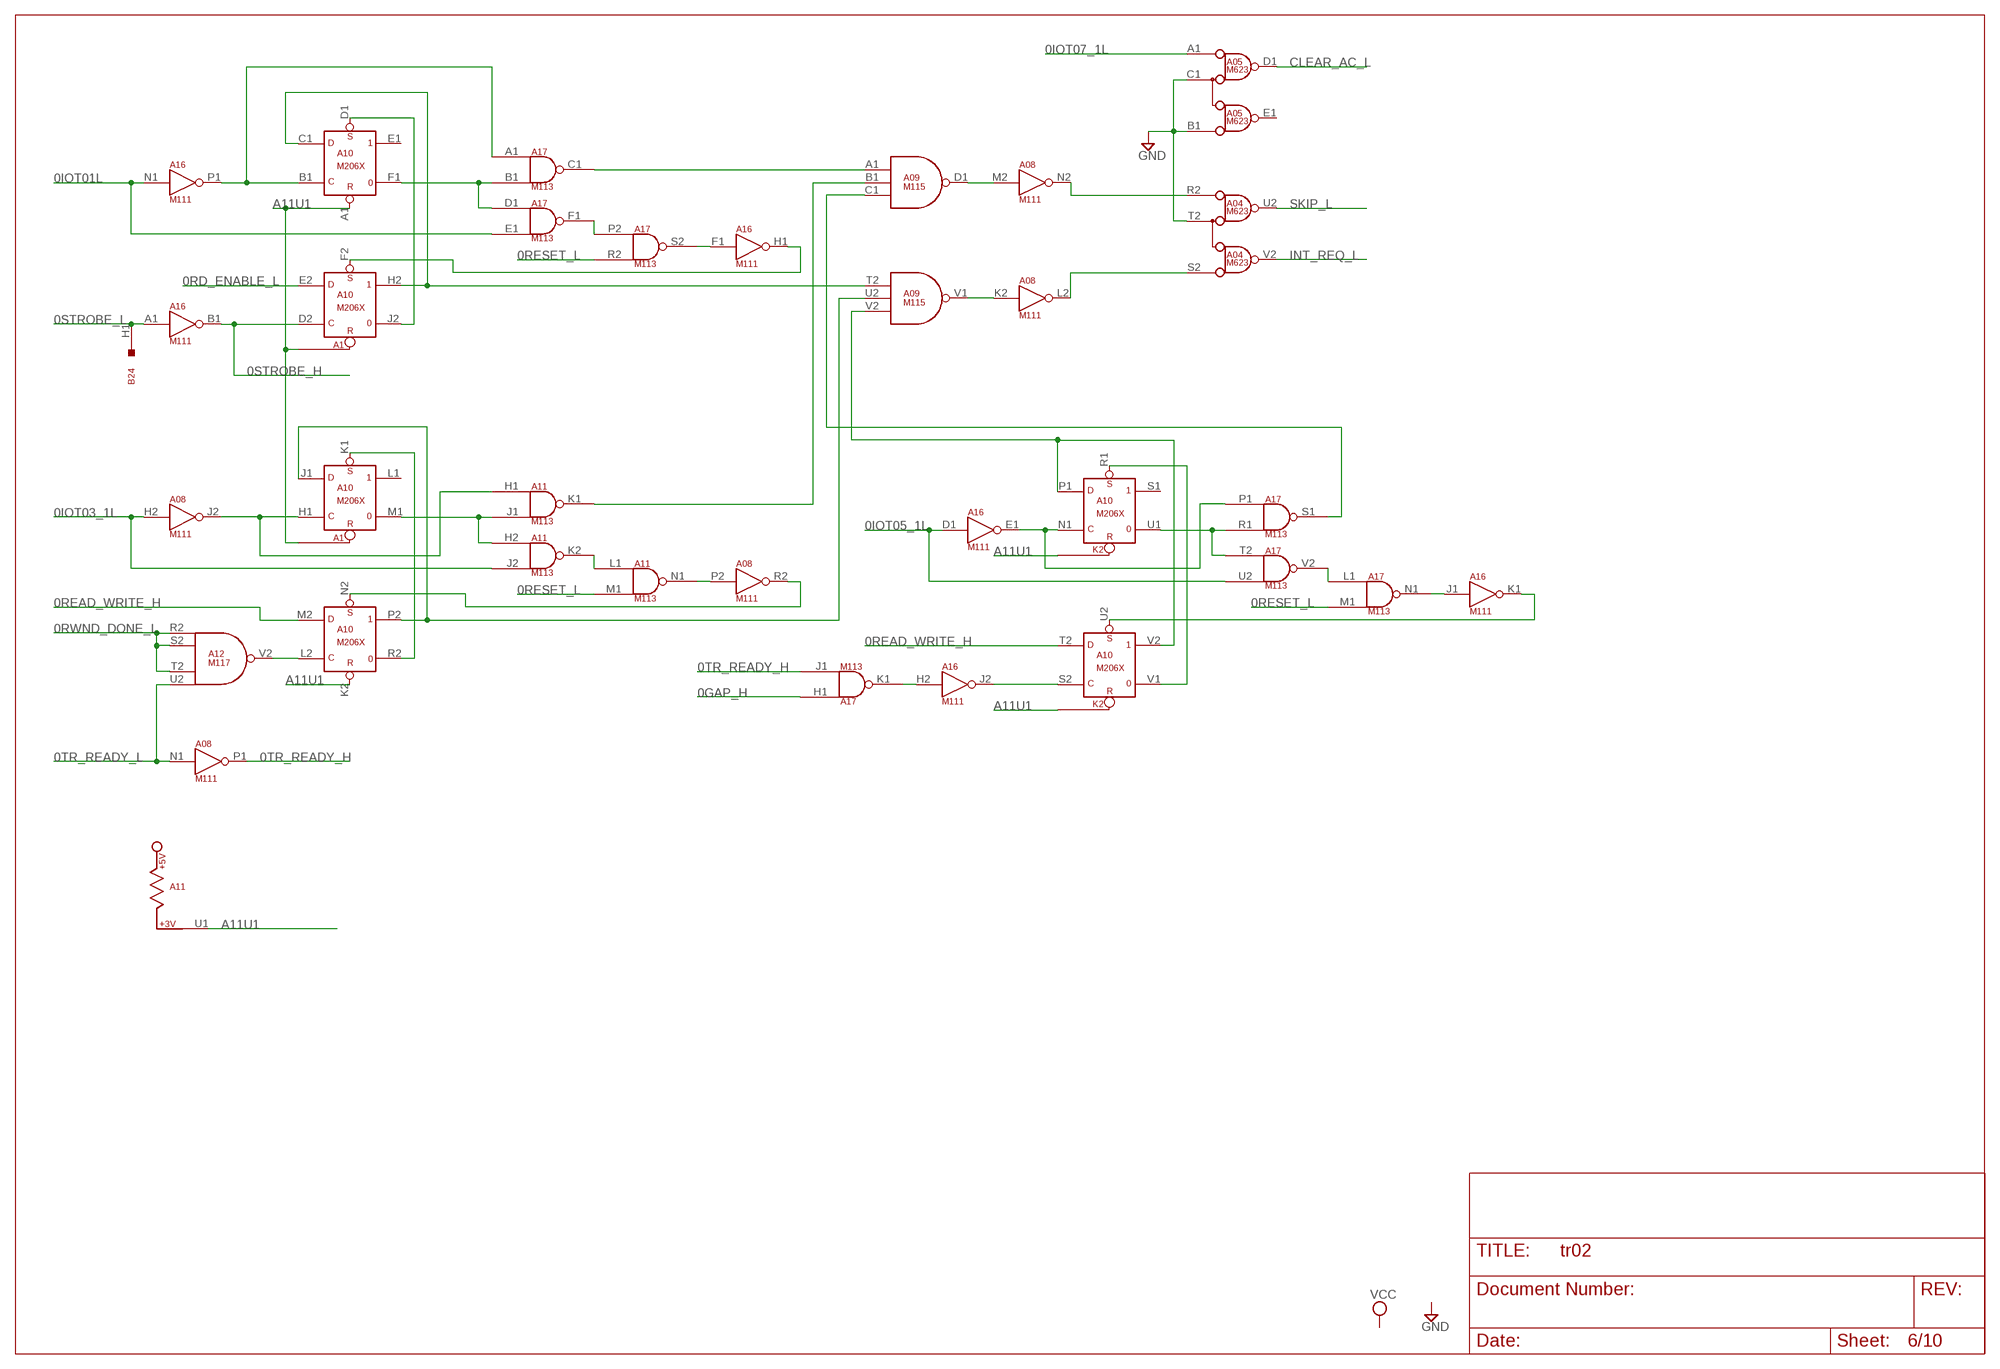
[diagram p5: schematic, sheet 6]

### Parts
A10  M206X  [H807]

### Nets
0GAP_H: A17.H1(K1:IN1) ; also sheet 3,4
0IOT01L: A16.N1(P1:IN) A17.E1(F1:IN2) ; also sheet 1
0IOT03_1L: A08.H2(J2:IN) A11.J2(K2:IN2) ; also sheet 1
0IOT05_1L: A16.D1(E1:IN) A17.U2(V2:IN2) ; also sheet 1
0IOT07_1L: A05.A1(D1:A) ; also sheet 1
0RD_ENABLE_L: A10.E2(H2:D) ; also sheet 4
0READ_WRITE_H: A10.M2(P2:D) A10.T2(V2:D) ; also sheet 3,5
0RESET_L: A11.M1(N1:IN2) A17.M1(N1:IN2) A17.R2(S2:IN2) ; also sheet 1,5
0RWND_DONE_L: A12.R2(V2:IN1) A12.S2(V2:IN2) A12.T2(V2:IN3) ; also sheet 4
0STROBE_H: A10.D2(H2:C) A16.B1(B1:OUT)
0STROBE_L: A16.A1(B1:IN) B24.H1 ; also sheet 4
0TR_READY_H: A08.P1(P1:OUT) A17.J1(K1:IN2)
0TR_READY_L: A08.N1(P1:IN) A12.U2(V2:IN4) ; also sheet 5
A11U1: A10.A1(E1:R) A10.K2(P2:R) A11.U1
CLEAR_AC_L: A05.D1(D1:D) ; also sheet 10
GND [supply]: A04.T2(U2:C) A05.B1(D1:B) A05.C1(D1:C) ; also sheet 3,5,7,10
INT_REQ_L: A04.V2(U2:E) ; also sheet 10
N$32: A10.B1(E1:C) A16.P1(P1:OUT) A17.A1(C1:IN1)
N$34: A16.F1(H1:IN) A17.S2(S2:OUT)
N$35: A08.J2(J2:OUT) A10.H1(L1:C) A11.H1(K1:IN1)
N$36: A10.L2(P2:C) A12.V2(V2:OUT)
N$37: A10.D1(E1:S) A10.J2
N$38: A09.T2(V1:IN1) A10.C1(E1:D) A10.H2
N$39: A10.F2(H2:S) A16.H1(H1:OUT)
N$40: A10.F1 A17.B1(C1:IN2) A17.D1(F1:IN1)
N$41: A17.F1(F1:OUT) A17.P2(S2:IN1)
N$42: A09.A1(D1:IN1) A17.C1(C1:OUT)
N$43: A10.K1(L1:S) A10.R2
N$44: A09.U2(V1:IN2) A10.J1(L1:D) A10.P2
N$45: A10.M1 A11.H2(K2:IN1) A11.J1(K1:IN2)
N$46: A16.H2(J2:IN) A17.K1(K1:OUT)
N$47: A09.B1(D1:IN2) A11.K1(K1:OUT)
N$48: A11.K2(K2:OUT) A11.L1(N1:IN1)
N$49: A08.P2(R2:IN) A11.N1(N1:OUT)
N$50: A08.R2(R2:OUT) A10.N2(P2:S)
N$51: A08.K2(L2:IN) A09.V1(V1:OUT)
N$52: A08.M2(N2:IN) A09.D1(D1:OUT)
N$53: A10.S2(V2:C) A16.J2(J2:OUT)
N$54: A10.N1(S1:C) A16.E1(E1:OUT) A17.P1(S1:IN1)
N$55: A04.R2(U2:A) A08.N2(N2:OUT)
N$56: A04.S2(U2:B) A08.L2(L2:OUT)
N$57: A09.V2(V1:IN3) A10.P1(S1:D) A10.V2
N$58: A10.R1(S1:S) A10.V1
N$59: A10.U2(V2:S) A16.K1(K1:OUT)
N$60: A10.U1 A17.R1(S1:IN2) A17.T2(V2:IN1)
N$62: A17.L1(N1:IN1) A17.V2(V2:OUT)
N$63: A16.J1(K1:IN) A17.N1(N1:OUT)
N$65: A09.C1(D1:IN3) A17.S1(S1:OUT)
SKIP_L: A04.U2(U2:D) ; also sheet 10
Unconnected: A05.E1(D1:E) A10.E1 A10.L1 A10.S1

## Sheet 7 of 10
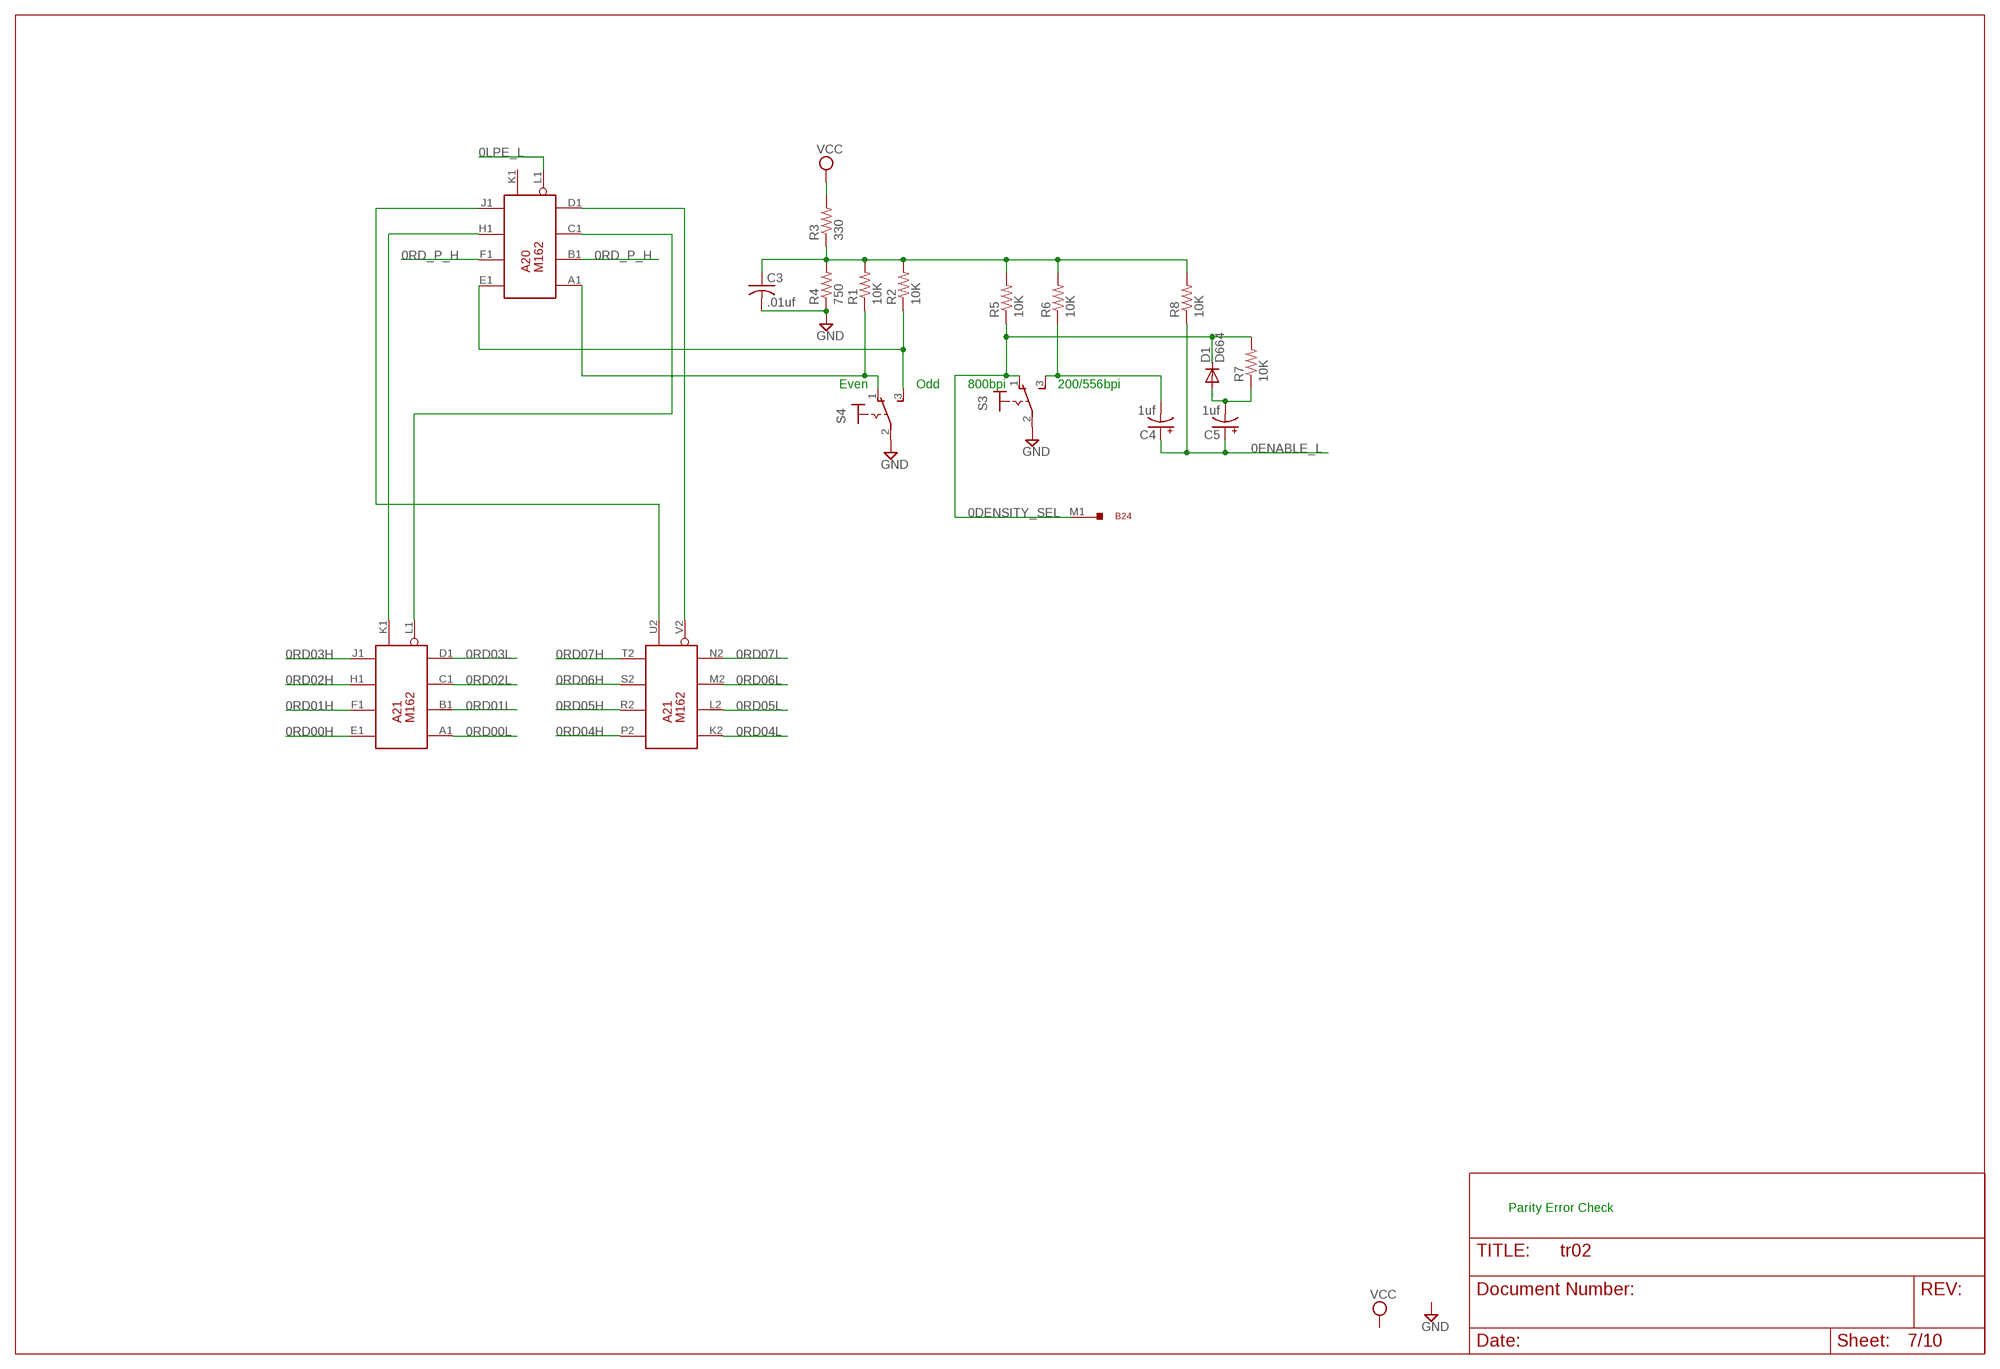
[diagram p6: schematic, sheet 7]

### Parts
A20  M162  [H807]
A21  M162  [H807]
C3  .01uf  C-US050-025X075  [C050-025X075]
C4  1uf  CPOL-USE22-6AXIAL  [E22-6]
C5  1uf  CPOL-USE22-6AXIAL  [E22-6]
D1  D664  1N4148DO35-10  [DO35-10]
R1  10K  R-US_0207/10  [0207/10]
R2  10K  R-US_0207/10  [0207/10]
R3  330  R-US_0207/10  [0207/10]
R4  750  R-US_0207/10  [0207/10]
R5  10K  R-US_0207/10  [0207/10]
R6  10K  R-US_0207/10  [0207/10]
R7  10K  R-US_0207/10  [0207/10]
R8  10K  R-US_0207/10  [0207/10]
S3  320-916  [320-916]
S4  320-916  [320-916]

### Nets
0DENSITY_SEL: B24.M1 D1.C R5.1 R7.2 S3.1(O)
0ENABLE_L: C4.+ C5.+ R8.1 ; also sheet 3
0LPE_L: A20.L1(K1:EVEN) ; also sheet 5
0RD00H: A21.E1(K1:1A) ; also sheet 5
0RD00L: A21.A1(K1:1B) ; also sheet 5
0RD01H: A21.F1(K1:2A) ; also sheet 5
0RD01L: A21.B1(K1:2B) ; also sheet 5
0RD02H: A21.H1(K1:4A) ; also sheet 5
0RD02L: A21.C1(K1:4B) ; also sheet 5
0RD03H: A21.J1(K1:8A) ; also sheet 5
0RD03L: A21.D1(K1:8B) ; also sheet 5
0RD04H: A21.P2(U2:1A) ; also sheet 5
0RD04L: A21.K2(U2:1B) ; also sheet 5
0RD05H: A21.R2(U2:2A) ; also sheet 5
0RD05L: A21.L2(U2:2B) ; also sheet 5
0RD06H: A21.S2(U2:4A) ; also sheet 5
0RD06L: A21.M2(U2:4B) ; also sheet 5
0RD07H: A21.T2(U2:8A) ; also sheet 5
0RD07L: A21.N2(U2:8B) ; also sheet 5
0RD_P_H: A20.B1(K1:2B) A20.F1(K1:2A) ; also sheet 5
GND [supply]: C3.2 R4.1 S3.2(P) S4.2(P) ; also sheet 3,5,6,10
N$61: A20.E1(K1:1A) R2.1 S4.3(S)
N$64: A20.A1(K1:1B) R1.1 S4.1(O)
N$66: A20.C1(K1:4B) A21.L1(K1:EVEN)
N$67: A20.J1(K1:8A) A21.U2(U2:ODD)
N$68: C5.- D1.A R7.1
N$69: A20.H1(K1:4A) A21.K1(K1:ODD)
N$70: A20.D1(K1:8B) A21.V2(U2:EVEN)
N$71: C3.1 R1.2 R2.2 R3.1 R4.2 R5.2 R6.2 R8.2
N$72: C4.- R6.1 S3.3(S)
VCC [supply]: R3.2
Unconnected: A20.K1(K1:ODD) A20.K2(U2:1B) A20.L2(U2:2B) A20.M2(U2:4B) A20.N2(U2:8B) A20.P2(U2:1A) A20.R2(U2:2A) A20.S2(U2:4A) A20.T2(U2:8A) A20.U2(U2:ODD) A20.V2(U2:EVEN)

### Notes on the sheet
- Even | Odd | 800bpi | 200/556bpi
- Parity Error Check

## Sheet 8 of 10
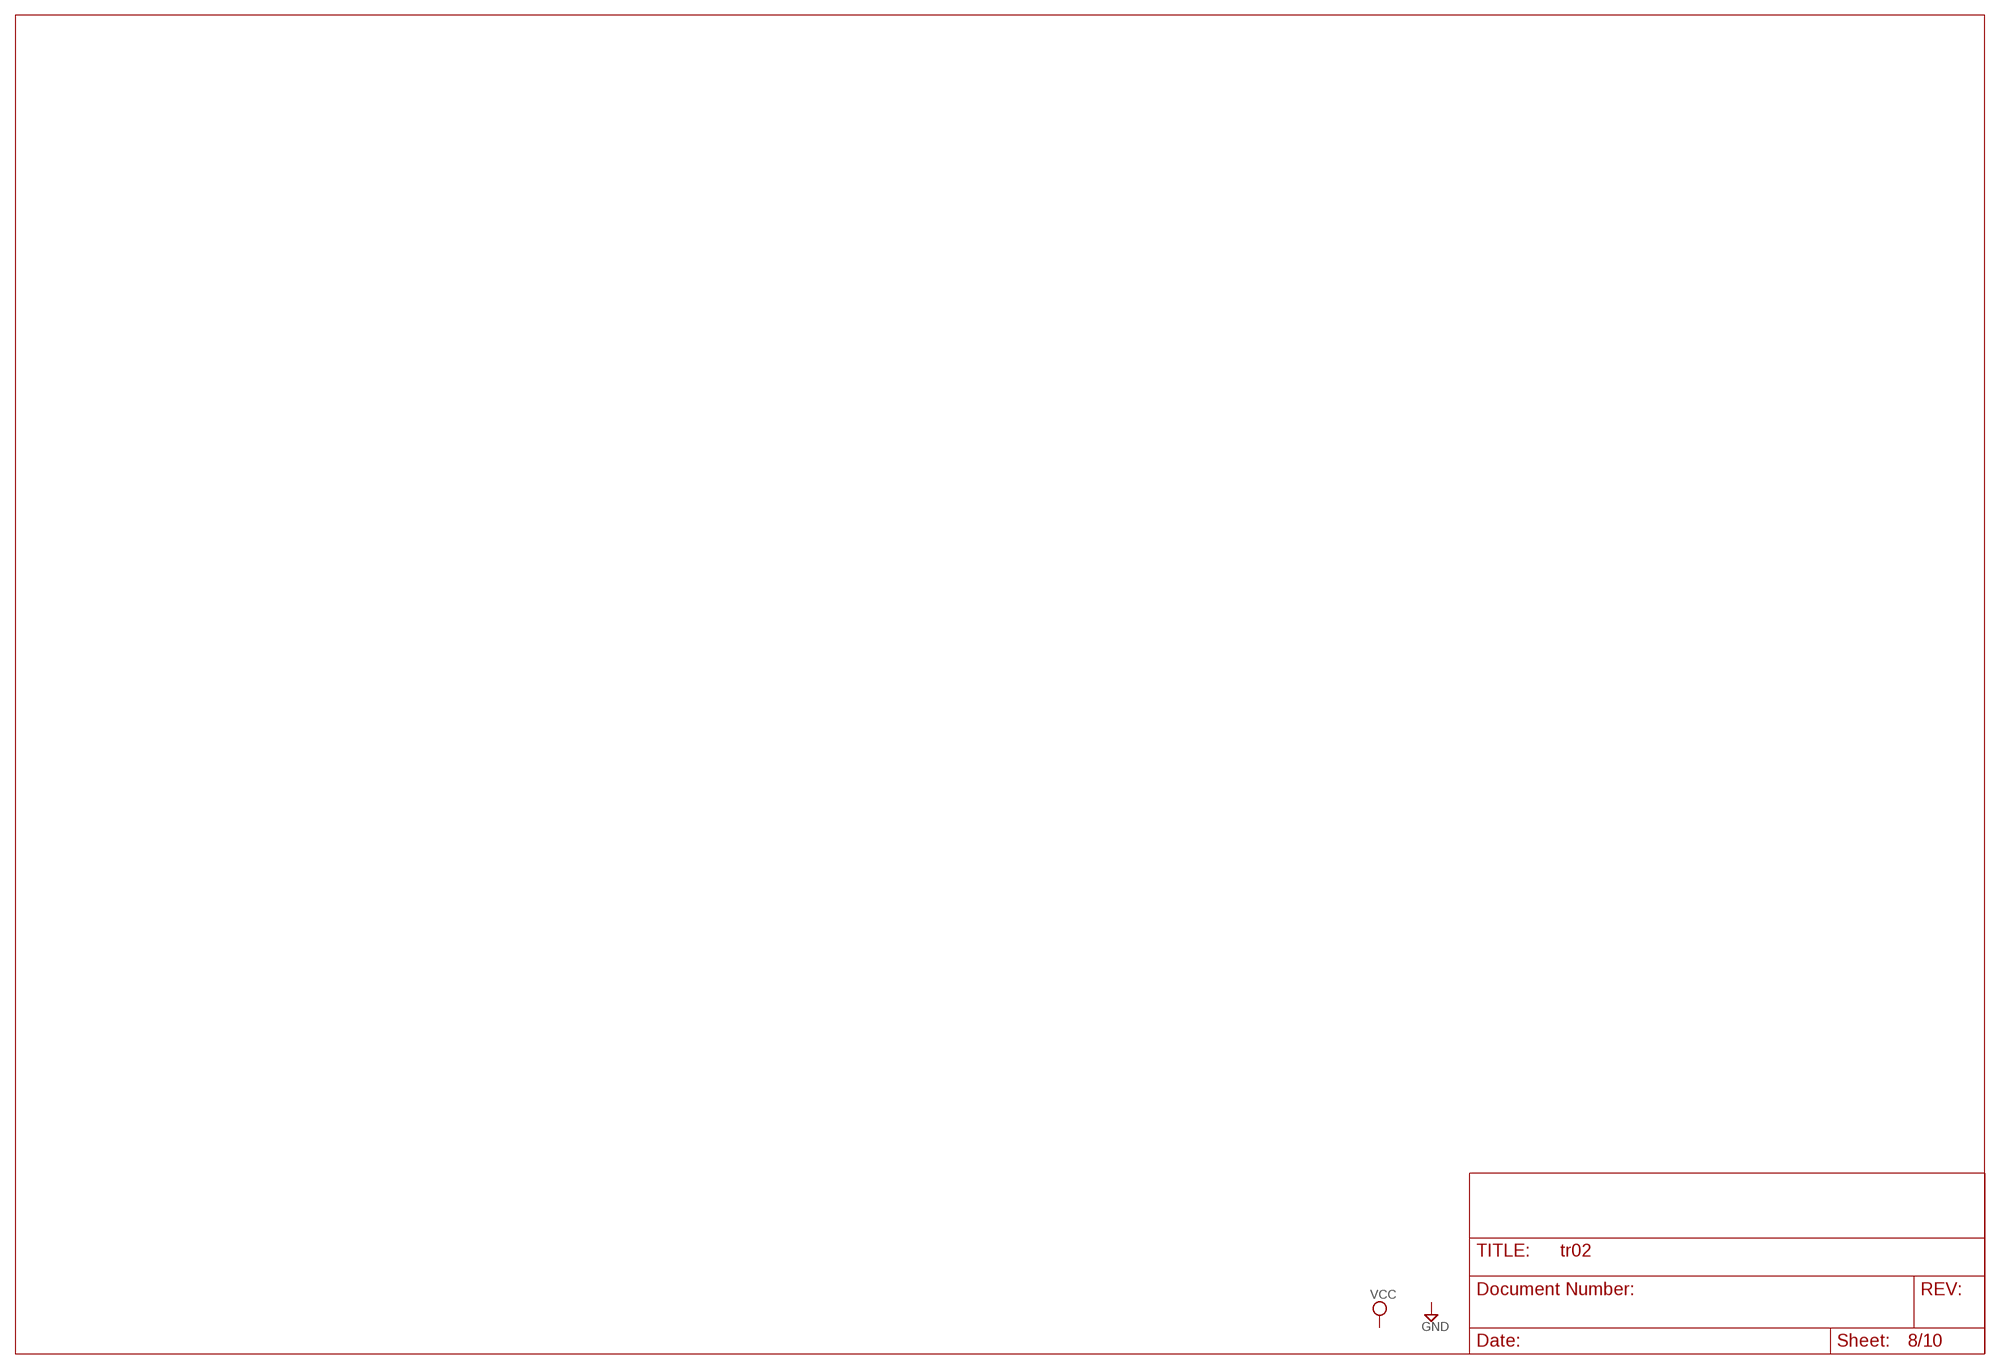
[diagram p7: schematic, sheet 8]

## Sheet 9 of 10
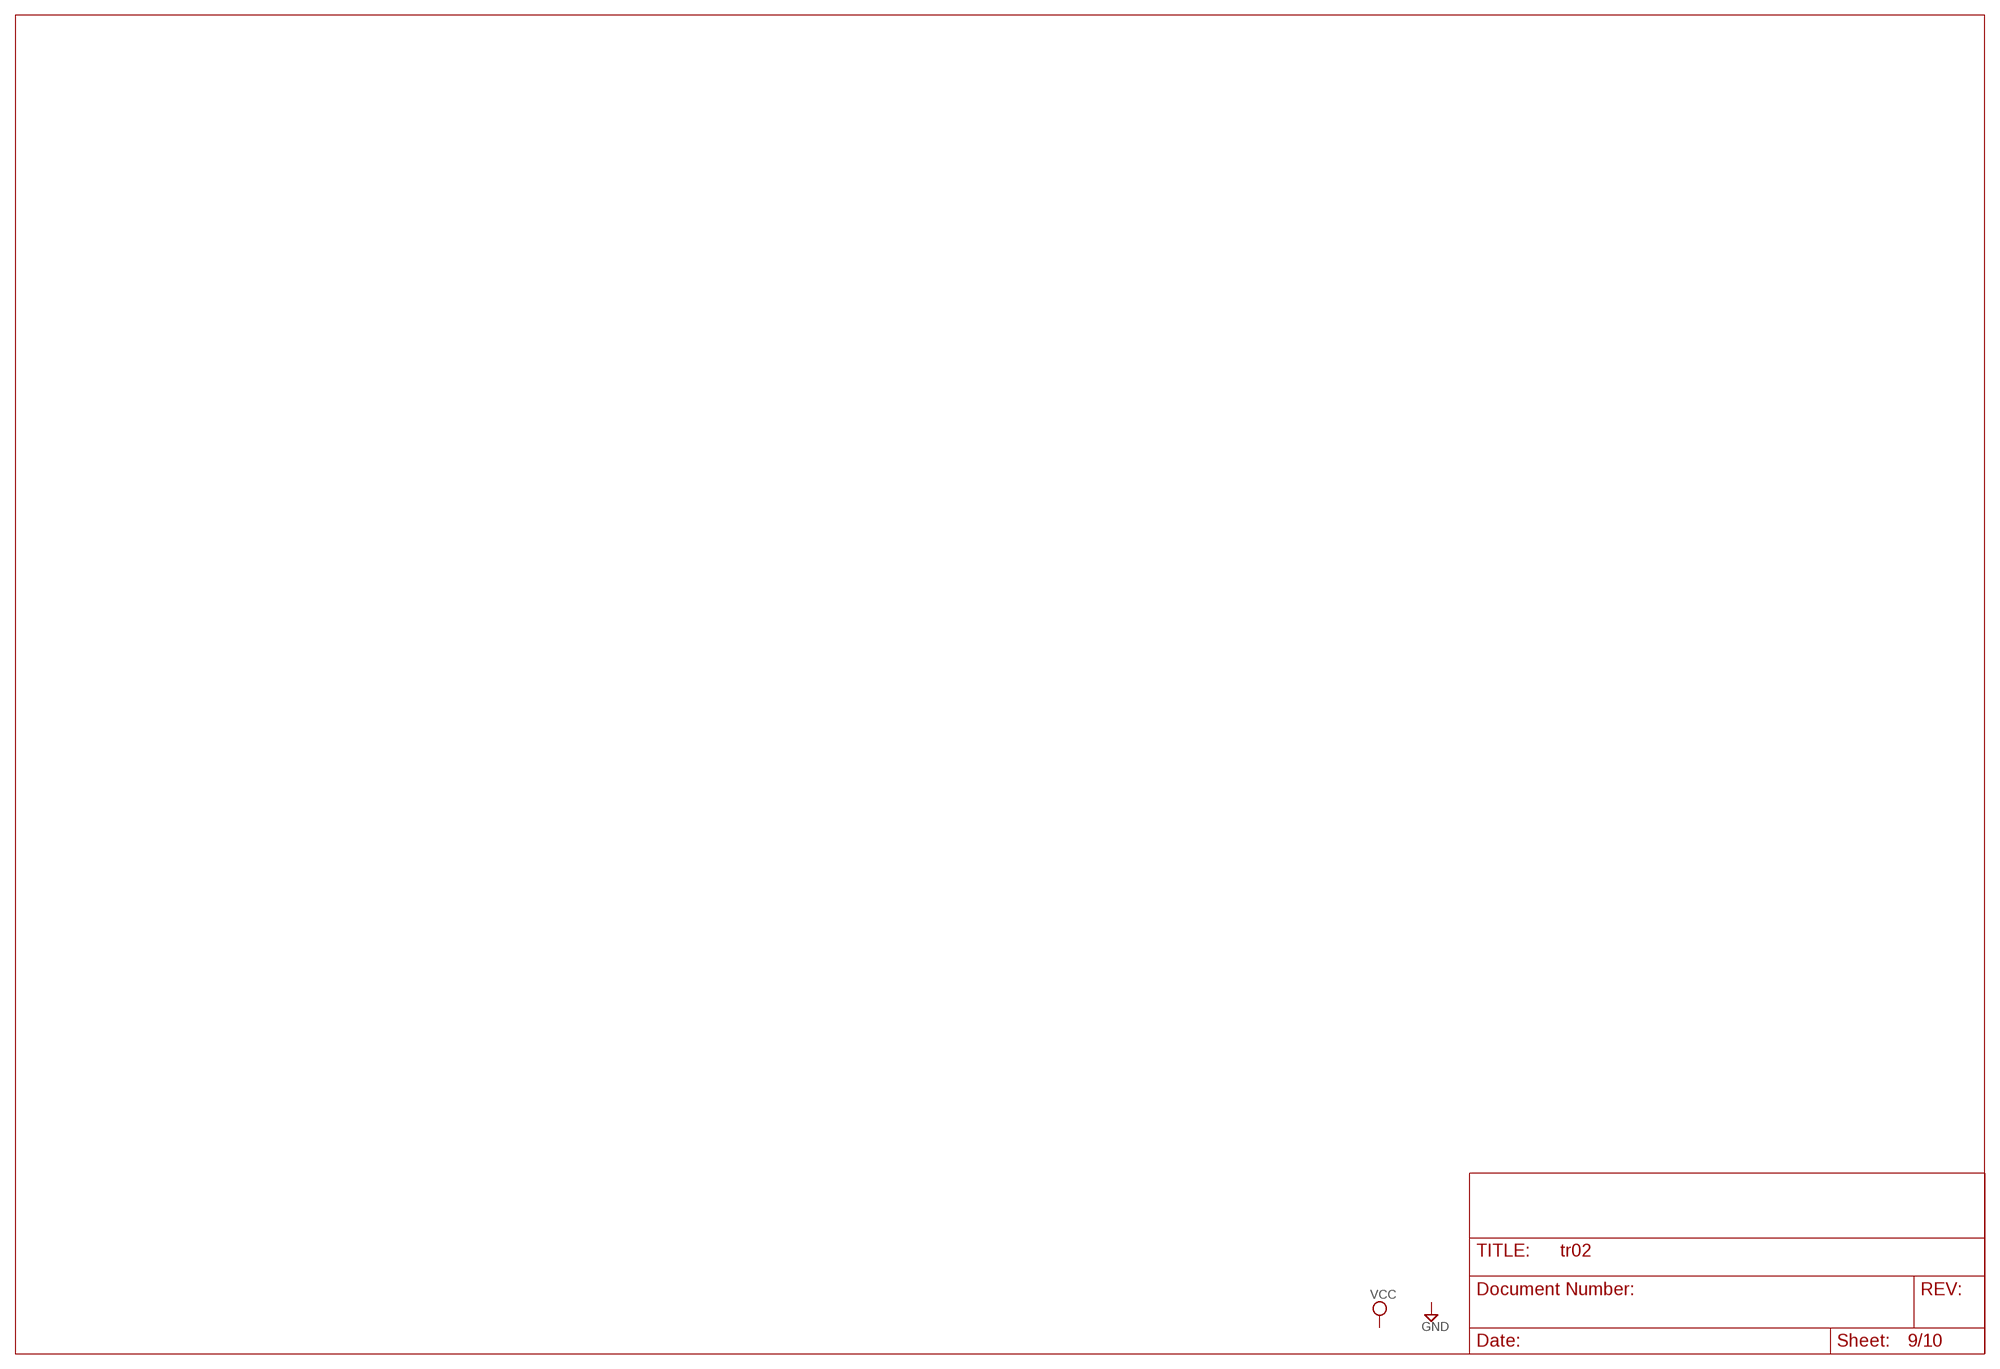
[diagram p8: schematic, sheet 9]

## Sheet 10 of 10
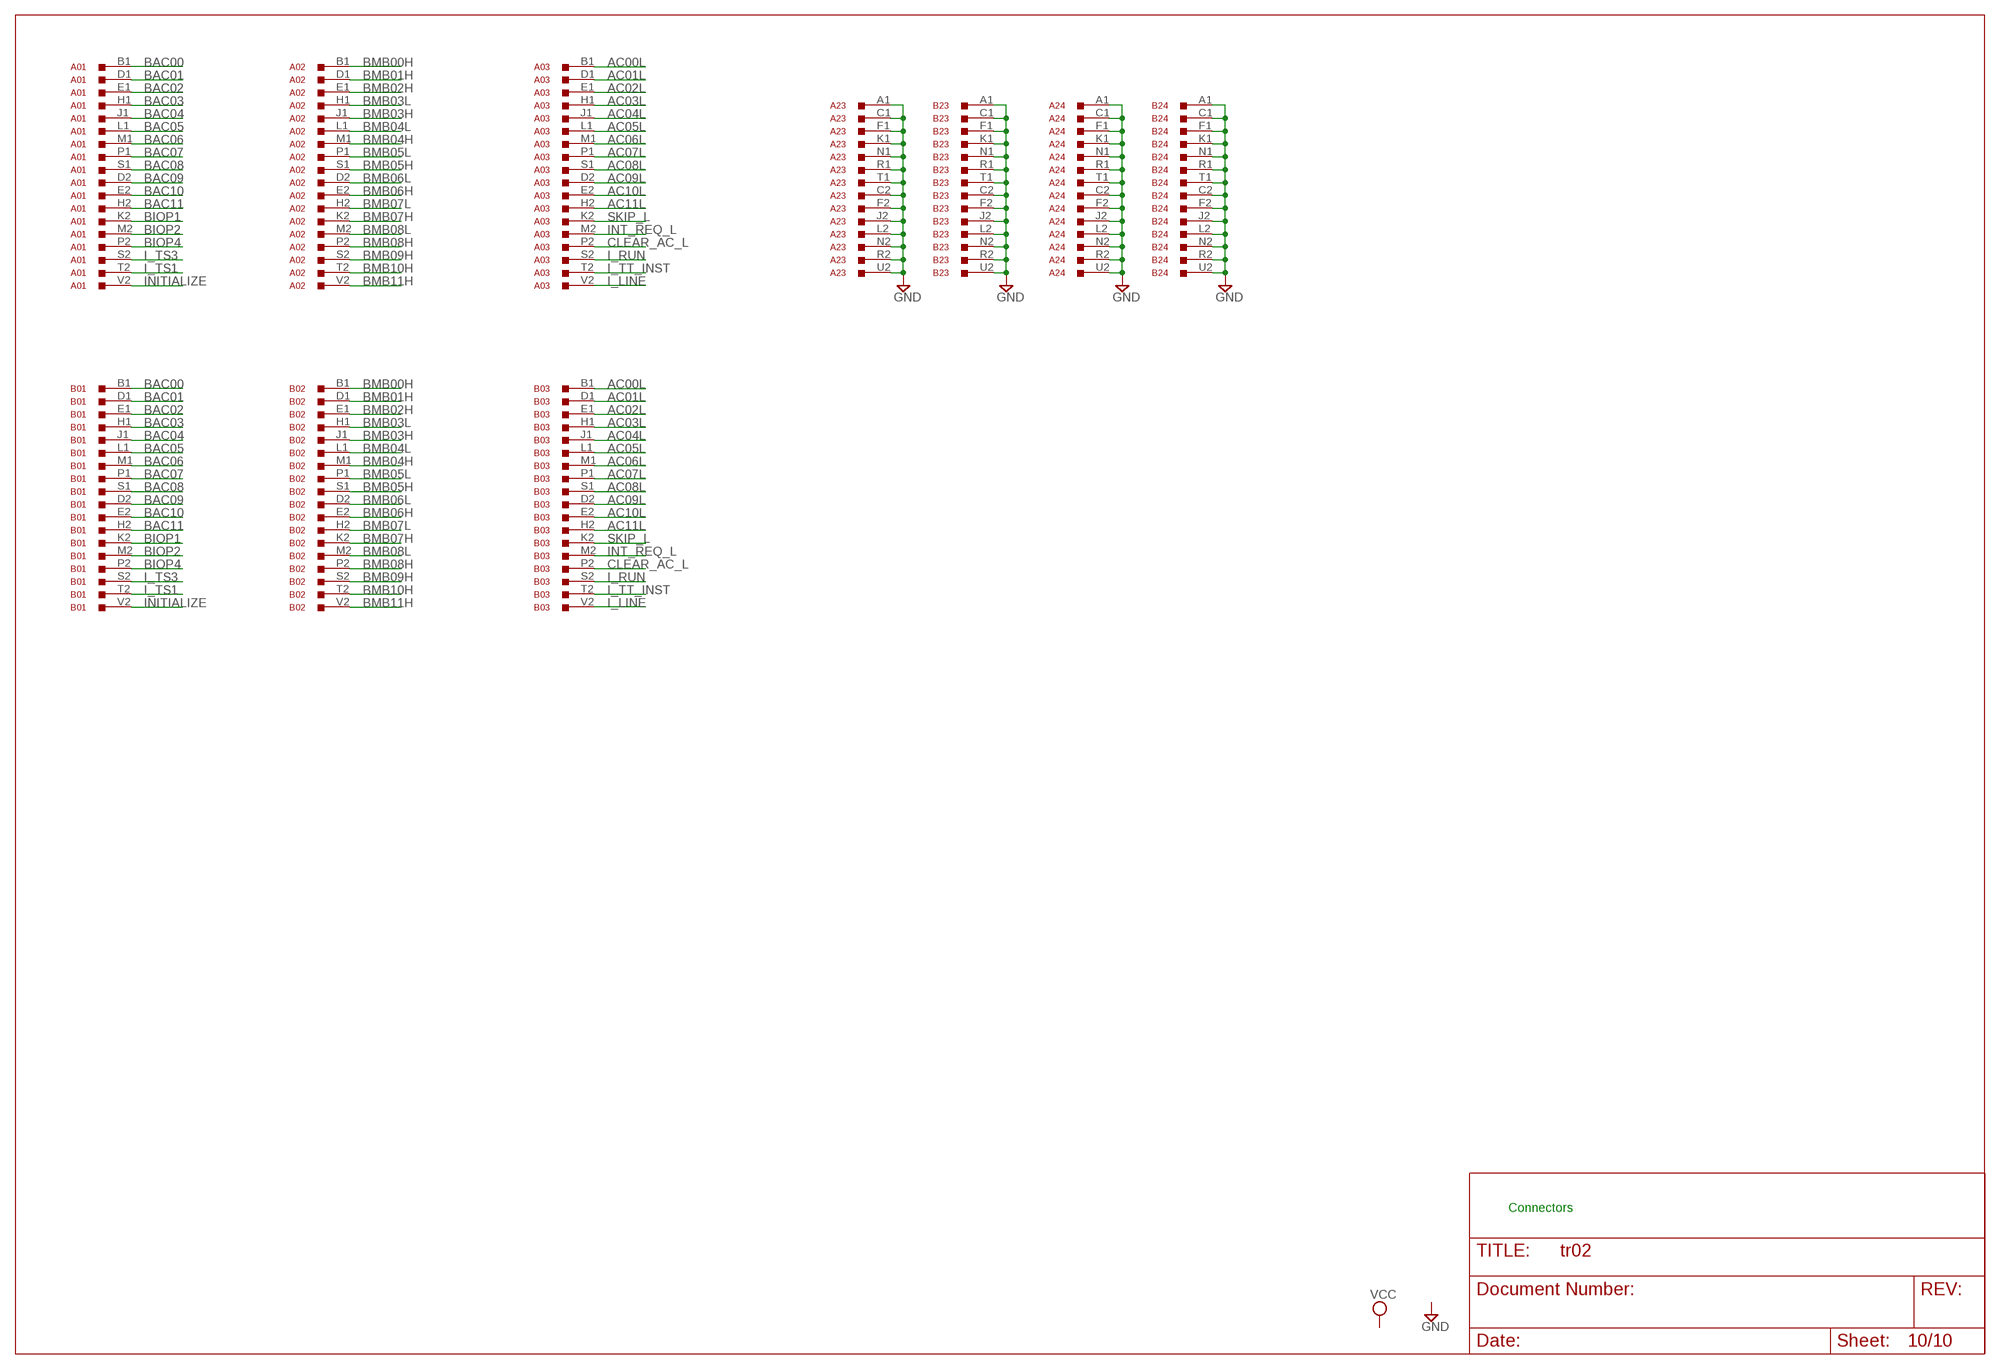
[diagram p9: schematic, sheet 10]

### Parts
A01  M903  [H807]
A02  M903  [H807]
A03  M903  [H807]
B01  M903  [H807]
B02  M903  [H807]
B03  M903  [H807]
B23  G784  M916  [H807]

### Nets
AC00L: A03.B1 B03.B1 ; also sheet 5
AC01L: A03.D1 B03.D1 ; also sheet 5
AC02L: A03.E1 B03.E1 ; also sheet 5
AC03L: A03.H1 B03.H1 ; also sheet 5
AC04L: A03.J1 B03.J1 ; also sheet 5
AC05L: A03.L1 B03.L1 ; also sheet 5
AC06L: A03.M1 B03.M1 ; also sheet 5
AC07L: A03.P1 B03.P1 ; also sheet 5
AC08L: A03.S1 B03.S1 ; also sheet 5
AC09L: A03.D2 B03.D2 ; also sheet 5
AC10L: A03.E2 B03.E2 ; also sheet 5
AC11L: A03.H2 B03.H2 ; also sheet 5
BAC00: A01.B1 B01.B1 ; also sheet 1,2
BAC01: A01.D1 B01.D1 ; also sheet 1,2
BAC02: A01.E1 B01.E1 ; also sheet 1,2
BAC03: A01.H1 B01.H1
BAC04: A01.J1 B01.J1 ; also sheet 1,2
BAC05: A01.L1 B01.L1 ; also sheet 1,2
BAC06: A01.M1 B01.M1 ; also sheet 1,2
BAC07: A01.P1 B01.P1 ; also sheet 1,2
BAC08: A01.S1 B01.S1 ; also sheet 1,2
BAC09: A01.D2 B01.D2 ; also sheet 1,2
BAC10: A01.E2 B01.E2 ; also sheet 1,2
BAC11: A01.H2 B01.H2 ; also sheet 1,2
BIOP1: A01.K2 B01.K2 ; also sheet 1,2
BIOP2: A01.M2 B01.M2 ; also sheet 1,2
BIOP4: A01.P2 B01.P2 ; also sheet 1,2
BMB00H: A02.B1 B02.B1
BMB01H: A02.D1 B02.D1
BMB02H: A02.E1 B02.E1
BMB03H: A02.J1 B02.J1 ; also sheet 1,2
BMB03L: A02.H1 B02.H1
BMB04H: A02.M1 B02.M1 ; also sheet 1,2
BMB04L: A02.L1 B02.L1
BMB05H: A02.S1 B02.S1 ; also sheet 1,2
BMB05L: A02.P1 B02.P1
BMB06H: A02.E2 B02.E2
BMB06L: A02.D2 B02.D2 ; also sheet 1,2
BMB07H: A02.K2 B02.K2
BMB07L: A02.H2 B02.H2 ; also sheet 1,2
BMB08H: A02.P2 B02.P2 ; also sheet 2
BMB08L: A02.M2 B02.M2 ; also sheet 1
BMB09H: A02.S2 B02.S2 ; also sheet 1,2
BMB10H: A02.T2 B02.T2 ; also sheet 1,2
BMB11H: A02.V2 B02.V2 ; also sheet 1,2
CLEAR_AC_L: A03.P2 B03.P2 ; also sheet 6
GND [supply]: A23.A1 A23.C1 A23.C2 A23.F1 A23.F2 A23.J2 A23.K1 A23.L2 A23.N1 A23.N2 A23.R1 A23.R2 A23.T1 A23.U2 A24.A1 A24.C1 A24.C2 A24.F1 A24.F2 A24.J2 A24.K1 A24.L2 A24.N1 A24.N2 A24.R1 A24.R2 A24.T1 A24.U2 B23.A1 B23.C1 B23.C2 B23.F1 B23.F2 B23.J2 B23.K1 B23.L2 B23.N1 B23.N2 B23.R1 B23.R2 B23.T1 B23.U2 B24.A1 B24.C1 B24.C2 B24.F1 B24.F2 B24.J2 B24.K1 B24.L2 B24.N1 B24.N2 B24.R1 B24.R2 B24.T1 B24.U2 ; also sheet 3,5,6,7
I_LINE: A03.V2 B03.V2
I_RUN: A03.S2 B03.S2
I_TS1: A01.T2 B01.T2
I_TS3: A01.S2 B01.S2
I_TT_INST: A03.T2 B03.T2
INITIALIZE: A01.V2 B01.V2 ; also sheet 1,2
INT_REQ_L: A03.M2 B03.M2 ; also sheet 6
SKIP_L: A03.K2 B03.K2 ; also sheet 6
Unconnected: B23.A2 B23.B1 B23.B2 B23.D1 B23.D2 B23.E1 B23.E2 B23.H1 B23.H2 B23.J1 B23.K2 B23.L1 B23.M1 B23.M2 B23.P1 B23.P2 B23.S1 B23.S2 B23.T2 B23.U1 B23.V1 B23.V2

### Notes on the sheet
- Connectors

## Power pins joined to a net without a drawn wire
GND: A01.A1 A01.C1 A01.C2 A01.F1 A01.F2 A01.J2 A01.K1 A01.L2 A01.N1 A01.N2 A01.R1 A01.R2 A01.T1 A01.U2 A02.A1 A02.C1 A02.C2 A02.F1 A02.F2 A02.J2 A02.K1 A02.L2 A02.N1 A02.N2 A02.R1 A02.R2 A02.T1 A02.U2 A03.A1 A03.C1 A03.C2 A03.F1 A03.F2 A03.J2 A03.K1 A03.L2 A03.N1 A03.N2 A03.R1 A03.R2 A03.T1 A03.U2 A04.C2(GND) A04.T1(GND) A04.U1(GND) A04.V1(GND) A05.C2(GND) A05.T1(GND) A05.U1(GND) A05.V1(GND) A06.C2(GND) A06.T1(GND) A07.C2(GND) A07.T1(GND) A08.C2(GND) A08.T1(GND) A09.C2(GND) A09.T1(GND) A10.C2(GND) A10.T1(GND) A11.C2(GND) A11.T1(GND) A12.C2(GND) A12.T1(GND) A13.C2(GND) A13.T1(GND) A14.C2(GND) A14.T1(GND) A15.C2(GND) A15.T1(GND) A16.C2(GND) A16.T1(GND) A17.C2(GND) A17.T1(GND) A18.C2(GND) A18.T1(GND) A19.C2(GND) A19.T1(GND) A20.C2(GND) A20.T1(GND) A21.C2(GND) A21.T1(GND) A22.C2(GND) A22.T1(GND) B01.A1 B01.C1 B01.C2 B01.F1 B01.F2 B01.J2 B01.K1 B01.L2 B01.N1 B01.N2 B01.R1 B01.R2 B01.T1 B01.U2 B02.A1 B02.C1 B02.C2 B02.F1 B02.F2 B02.J2 B02.K1 B02.L2 B02.N1 B02.N2 B02.R1 B02.R2 B02.T1 B02.U2 B03.A1 B03.C1 B03.C2 B03.F1 B03.F2 B03.J2 B03.K1 B03.L2 B03.N1 B03.N2 B03.R1 B03.R2 B03.T1 B03.U2 B06.C2(GND) B06.T1(GND) B07.C2(GND) B07.T1(GND) B08.C2(GND) B08.T1(GND) B09.C2(GND) B09.T1(GND) B11.C2(GND) B11.T1(GND) B15.C2(GND) B15.T1(GND) B18.C2(GND) B18.T1(GND)
VCC: A04.A2(VCC) A05.A2(VCC) A06.A2(VCC) A07.A2(VCC) A08.A2(VCC) A09.A2(VCC) A10.A2(VCC) A11.A2(VCC) A12.A2(VCC) A13.A2(VCC) A14.A2(VCC) A15.A2(VCC) A16.A2(VCC) A17.A2(VCC) A18.A2(VCC) A19.A2(VCC) A20.A2(VCC) A21.A2(VCC) A22.A2(VCC) B06.A2(VCC) B07.A2(VCC) B08.A2(VCC) B09.A2(VCC) B11.A2(VCC) B15.A2(VCC) B18.A2(VCC)

## Library data of the parts
A01-A03 B01-B03 = dec-m:M903: Two-sided Posibus cable/connector.
A04 A05 = dec-m:M623: 6 Dual Bus Drivers
A06 B06 = dec-m:M103: M103 Device Selector Used to decode IOT requests.
A07 B07 = dec-m:M101: Bus Data Interface The M101 contains 15 two-input NAND gates. One input of each gate is tied to a common line so that all data signals can be enabled simultaneously. Each data signal presents one TTL load. The common input presents 15 loads. Each output can drive 10 loads. Power: 5V@82ma (max.)
A08 A16 A22 B08 = dec-m:M111: Sixteen inverters.
A09 A15 B09 B15 = dec-m:M115: 8 3-input NAND Gates
A10 A14 = dec-m:M206X: Two sets of 3 D flip-flops
A11 A17 B11 = dec-m:M113: 10 2-input NAND Gates
A12 A18 B18 = dec-m:M117: 6 4-input NAND Gates
A13 = dec-m:M307: Dual Integrating One-Shot
A19 = dec-m:M302: Dual one-shot
A20 A21 = dec-m:M162: Parity Circuit
A23 A24 B23 B24 = dec-m:M916: Simple 36 pin connector/wire cable
C1 C2 C4 C5 = rcl:CPOL-US: POLARIZED CAPACITOR, American symbol
C3 = rcl:C-US: CAPACITOR, American symbol
D1 = diode:1N4148: DIODE high speed (Philips)
R1-R8 = rcl:R-US_: RESISTOR, American symbol
S3 S4 = switch:320-916: TOGGLE SWITCH distributor RS Components

## Net classes
1 supply: width 0.203 mm